# EAGLE design Party_Xmass_LED_controller (EAGLE 9.2.2)

## Sheet 1 of 3
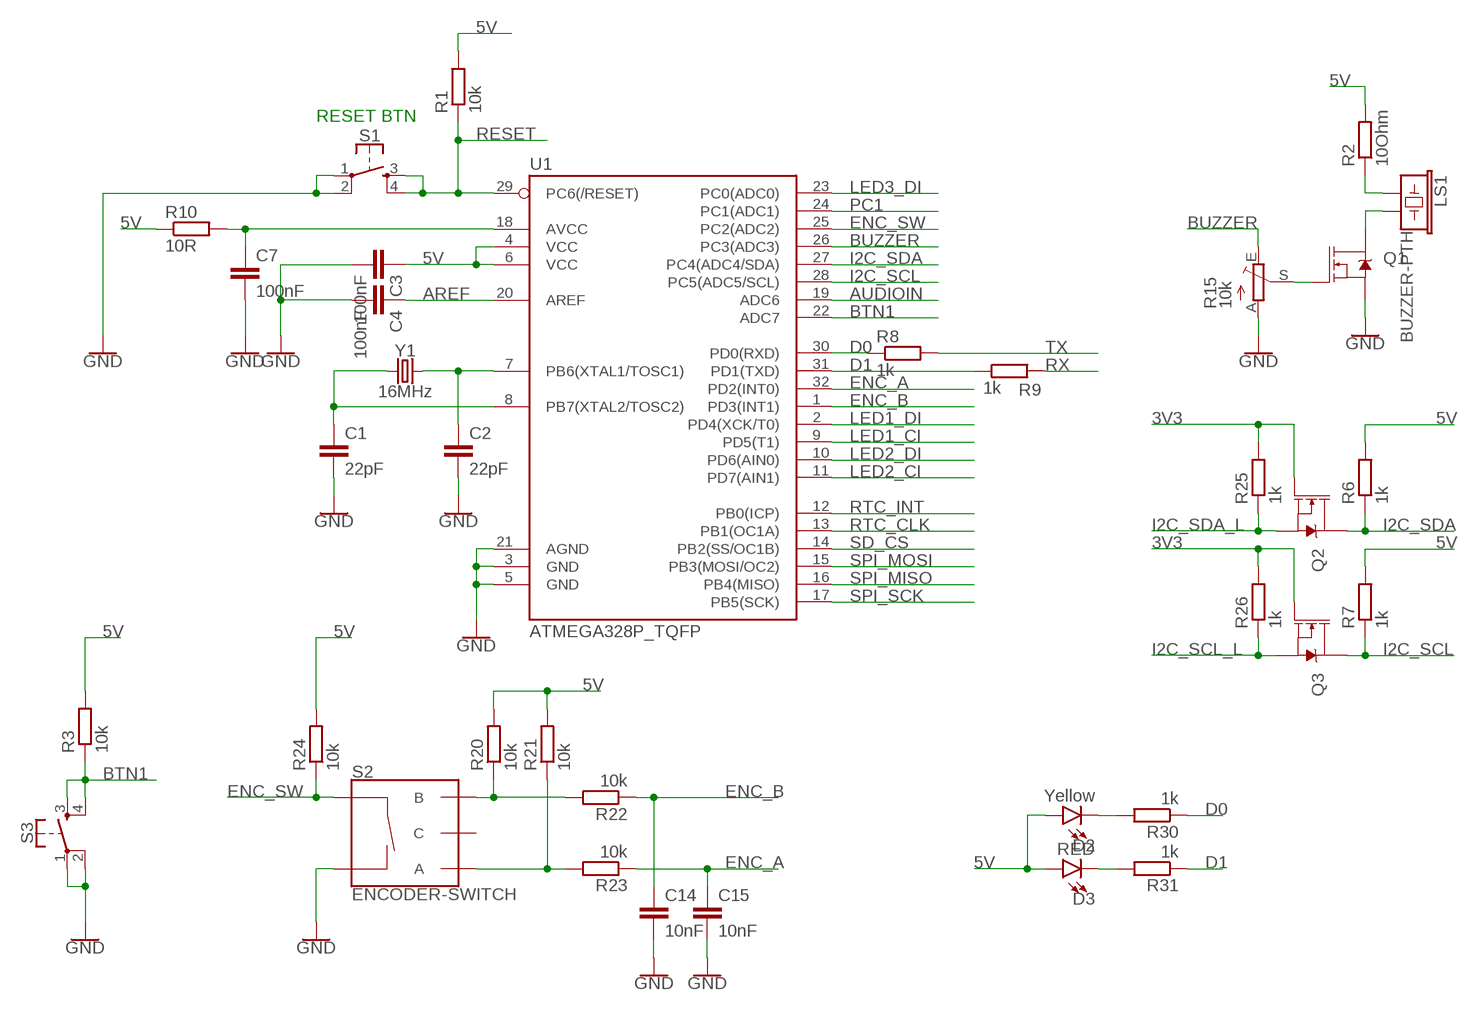
[diagram p0: schematic, sheet 1]

### Parts
C1  22pF  C-EUC0603  [C0603]
C2  22pF  C-EUC0603  [C0603]
C3  100nF  C-EUC0603  [C0603]
C4  100nF  C-EUC0603  [C0603]
C7  100nF  C-EUC0603  [C0603]
C14  10nF  C-EUC0603  [C0603]
C15  10nF  C-EUC0603  [C0603]
D2  Yellow  LED-YELLOW0603  [LED-0603]
D3  RED  LED-RED0603  [LED-0603]
LS1  BUZZER-PTH  [BUZZER-12MM]
Q1  MOSFET-NCH-BSS138  [SOT23-3]
Q2  MOSFET-NCH-BSS138  [SOT23-3]
Q3  MOSFET-NCH-BSS138  [SOT23-3]
R1  10k  R-EU_R0603  [R0603]
R2  10Ohm  R-EU_R0603  [R0603]
R3  10k  R-EU_R0603  [R0603]
R6  1k  R-EU_R0603  [R0603]
R7  1k  R-EU_R0603  [R0603]
R8  1k  R-EU_R0603  [R0603]
R9  1k  R-EU_R0603  [R0603]
R10  10R  R-EU_R0603  [R0603]
R15  10k  TRIM_EU-CA6V  [CA6V]
R20  10k  R-EU_R0603  [R0603]
R21  10k  R-EU_R0603  [R0603]
R22  10k  R-EU_R0603  [R0603]
R23  10k  R-EU_R0603  [R0603]
R24  10k  R-EU_R0603  [R0603]
R25  1k  R-EU_R0603  [R0603]
R26  1k  R-EU_R0603  [R0603]
R30  1k  R-EU_R0603  [R0603]
R31  1k  R-EU_R0603  [R0603]
S1  MOMENTARY-SWITCH-SPST-2-SMD-5.2MM  [TACTILE_SWITCH_SMD_5.2MM]
S2  ENCODER-SWITCH  [ROTARY_ENC_PLAIN]
S3  MOMENTARY-SWITCH-SPST-2-SMD-5.2MM  [TACTILE_SWITCH_SMD_5.2MM]
U1  ATMEGA328P_TQFP  [TQFP32-08]
Y1  16MHz  CRYSTAL-16MHZSMD-5X3.2  [CRYSTAL-SMD-5X3.2-4PAD]

### Nets
3V3: Q2.1(G) Q3.1(G) R25.2 R26.2 ; also sheet 2,3
5V: C3.1 D2.A D3.A R1.2 R2.2 R3.2 R6.2 R7.2 R10.1 R20.2 R21.2 R24.2 U1.4(VCC) U1.6(VCC) ; also sheet 2,3
AREF: C4.1 U1.20(AREF) ; also sheet 3
AUDIOIN: U1.19(ADC6) ; also sheet 3
BTN1: R3.1 S3.3 S3.4 U1.22(ADC7)
BUZZER: R15.E U1.26(PC3(ADC3))
D0: R8.1 R30.1 U1.30(PD0(RXD))
D1: R9.1 R31.1 U1.31(PD1(TXD))
ENC_A: C15.1 R23.1 U1.32(PD2(INT0))
ENC_B: C14.1 R22.1 U1.1(PD3(INT1))
ENC_SW: R24.1 S2.SW+ U1.25(PC2(ADC2))
GND: C1.2 C2.2 C3.2 C4.2 C7.2 C14.2 C15.2 Q1.2(S) R15.A S1.1 S1.2 S2.SW- S3.1 S3.2 U1.3(GND) U1.5(GND) U1.21(AGND) ; also sheet 2,3
I2C_SCL: Q3.3(D) R7.1 U1.28(PC5(ADC5/SCL)) ; also sheet 3
I2C_SCL_L: Q3.2(S) R26.1 ; also sheet 3
I2C_SDA: Q2.3(D) R6.1 U1.27(PC4(ADC4/SDA)) ; also sheet 3
I2C_SDA_L: Q2.2(S) R25.1 ; also sheet 3
LED1_CI: U1.9(PD5(T1)) ; also sheet 2
LED1_DI: U1.2(PD4(XCK/T0)) ; also sheet 2
LED2_CI: U1.11(PD7(AIN1)) ; also sheet 2
LED2_DI: U1.10(PD6(AIN0)) ; also sheet 2
LED3_DI: U1.23(PC0(ADC0)) ; also sheet 2
N$3: R20.1 R22.2 S2.B
N$4: LS1.- Q1.3(D)
N$5: LS1.+ R2.1
N$6: C2.1 U1.7(PB6(XTAL1/TOSC1)) Y1.3
N$7: C1.1 U1.8(PB7(XTAL2/TOSC2)) Y1.1
N$17: C7.1 R10.2 U1.18(AVCC)
N$18: R21.1 R23.2 S2.A
N$20: Q1.1(G) R15.S
N$40: D2.C R30.2
N$41: D3.C R31.2
PC1: U1.24(PC1(ADC1)) ; also sheet 3
RESET: R1.1 S1.3 S1.4 U1.29(PC6(/RESET)) ; also sheet 2,3
RTC_CLK: U1.13(PB1(OC1A)) ; also sheet 3
RTC_INT: U1.12(PB0(ICP)) ; also sheet 3
RX: R9.2 ; also sheet 2
SD_CS: U1.14(PB2(SS/OC1B)) ; also sheet 3
SPI_MISO: U1.16(PB4(MISO)) ; also sheet 3
SPI_MOSI: U1.15(PB3(MOSI/OC2)) ; also sheet 3
SPI_SCK: U1.17(PB5(SCK)) ; also sheet 3
TX: R8.2 ; also sheet 2
Unconnected: S2.C

### Notes on the sheet
- RESET BTN

## Sheet 2 of 3
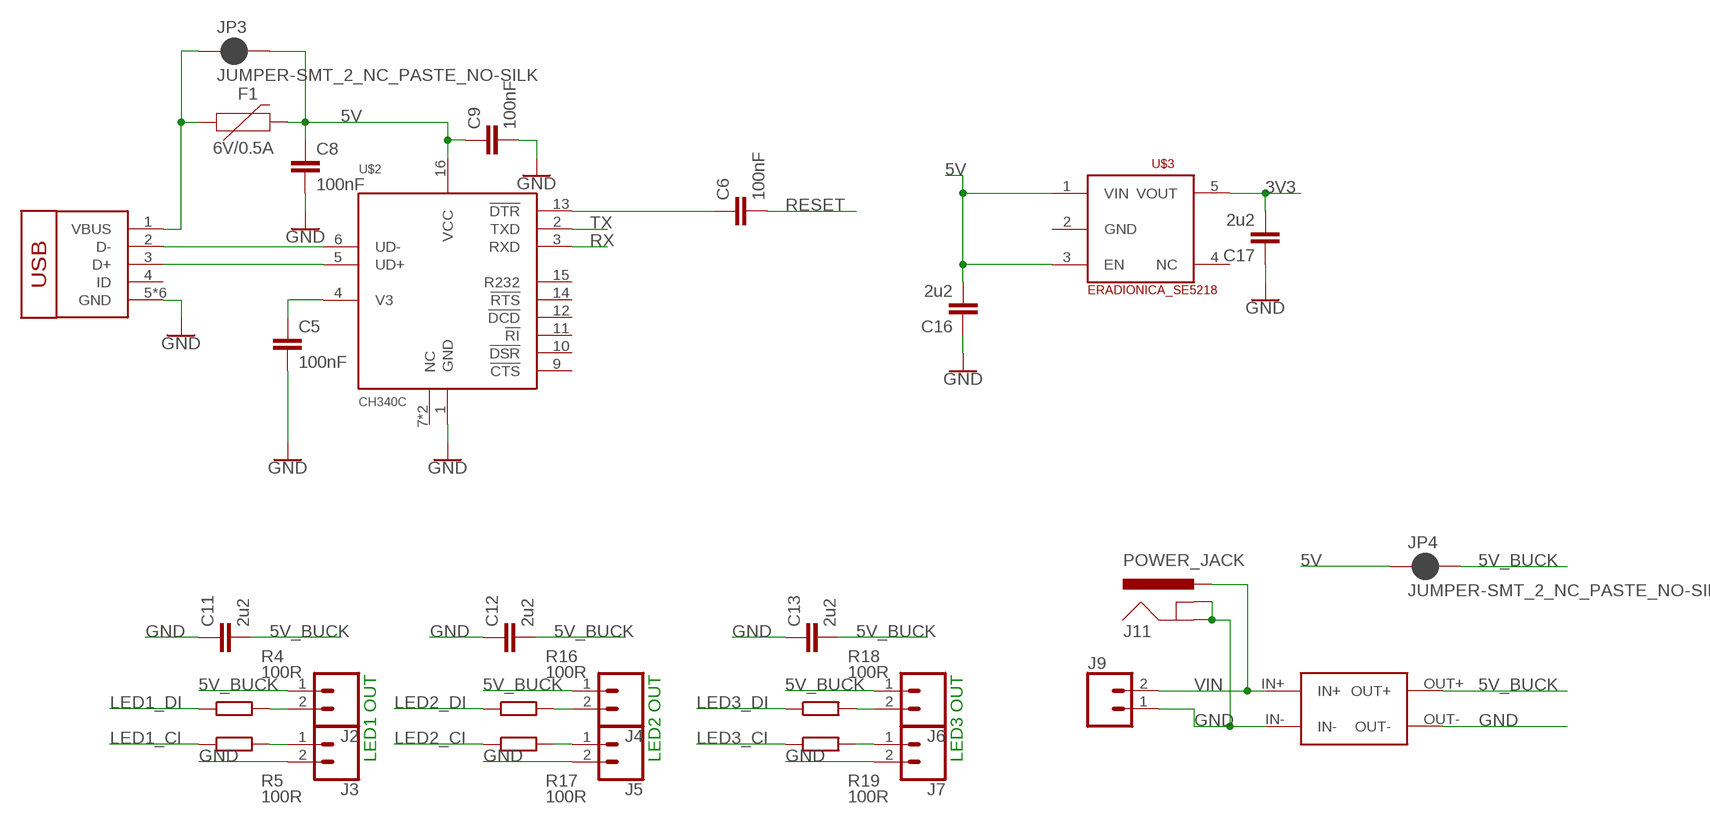
[diagram p1: schematic, sheet 2]

### Parts
C5  100nF  C-EUC0603  [C0603]
C6  100nF  C-EUC0603  [C0603]
C8  100nF  C-EUC0603  [C0603]
C9  100nF  C-EUC0603  [C0603]
C11  2u2  C-EUC0603  [C0603]
C12  2u2  C-EUC0603  [C0603]
C13  2u2  C-EUC0603  [C0603]
C16  2u2  C-EUC0603  [C0603]
C17  2u2  C-EUC0603  [C0603]
F1  6V/0.5A  PPTC_HALF-AMP  [1206]
J2  CONN_023.5MM  [SCREWTERMINAL-3.5MM-2]
J3  CONN_023.5MM  [SCREWTERMINAL-3.5MM-2]
J4  CONN_023.5MM  [SCREWTERMINAL-3.5MM-2]
J5  CONN_023.5MM  [SCREWTERMINAL-3.5MM-2]
J6  CONN_023.5MM  [SCREWTERMINAL-3.5MM-2]
J7  CONN_023.5MM  [SCREWTERMINAL-3.5MM-2]
J9  CONN_025MM  [SCREWTERMINAL-5MM-2]
J11  POWER_JACK  [POWER_JACK_PTH]
JP3  JUMPER-SMT_2_NC_PASTE_NO-SILK  [SMT-JUMPER_2_NC_PASTE_NO-SILK]
JP4  JUMPER-SMT_2_NC_PASTE_NO-SILK  [SMT-JUMPER_2_NC_PASTE_NO-SILK]
R4  100R  R-EU_R0603  [R0603]
R5  100R  R-EU_R0603  [R0603]
R16  100R  R-EU_R0603  [R0603]
R17  100R  R-EU_R0603  [R0603]
R18  100R  R-EU_R0603  [R0603]
R19  100R  R-EU_R0603  [R0603]
U$1  ERADIONICA_USB-MICRO  [ERADIONICA_U-F-M5DD-Y-L]
U$2  CH340C  [SOP-16]
U$3  ERADIONICA_SE5218  [ERADIONICA_SOT23-5]
U$4  STEPDOWN_MODULE_LM2596  [STEPDOWN_MODULE_LM2596]

### Nets
3V3: C17.2 U$3.5(VOUT) ; also sheet 1,3
5V: C8.1 C9.1 C16.2 F1.2 JP3.2 JP4.1 U$2.16(VCC) U$3.1(VIN) U$3.3(EN) ; also sheet 1,3
5V_BUCK: C11.2 C12.2 C13.2 J2.1 J4.1 J6.1 JP4.2 U$4.OUT+ ; also sheet 3
GND: C5.2 C8.2 C9.2 C11.1 C12.1 C13.1 C16.1 C17.1 J3.2 J5.2 J7.2 J9.1 J11.GND J11.GNDBREAK U$1.5(GND) U$1.PAD(GND) U$1.SHIELD1(GND) U$1.SHIELD2(GND) U$1.SHIELD3(GND) U$1.SHIELD4(GND) U$2.1(GND) U$4.IN- U$4.OUT- ; also sheet 1,3
LED1_CI: R5.1 ; also sheet 1
LED1_DI: R4.1 ; also sheet 1
LED2_CI: R17.1 ; also sheet 1
LED2_DI: R16.1 ; also sheet 1
LED3_CI: R19.1 ; also sheet 3
LED3_DI: R18.1 ; also sheet 1
N$8: C5.1 U$2.4(V3)
N$9: C6.1 U$2.13(!DTR)
N$14: U$1.2(D-) U$2.6(UD-)
N$15: U$1.3(D+) U$2.5(UD+)
N$16: F1.1 JP3.1 U$1.1(VBUS)
N$22: J2.2 R4.2
N$23: J3.1 R5.2
N$33: J4.2 R16.2
N$34: J5.1 R17.2
N$37: J6.2 R18.2
N$38: J7.1 R19.2
RESET: C6.2 ; also sheet 1,3
RX: U$2.3(RXD) ; also sheet 1
TX: U$2.2(TXD) ; also sheet 1
VIN: J9.2 J11.PWR U$4.IN+
Unconnected: U$1.4(ID) U$2.7(NC) U$2.8(NC) U$2.9(!CTS) U$2.10(!DSR) U$2.11(!RI) U$2.12(!DCD) U$2.14(!RTS) U$2.15(R232) U$3.2(GND) U$3.4(NC)

### Notes on the sheet
- LED1 OUT | LED2 OUT | LED3 OUT

## Sheet 3 of 3
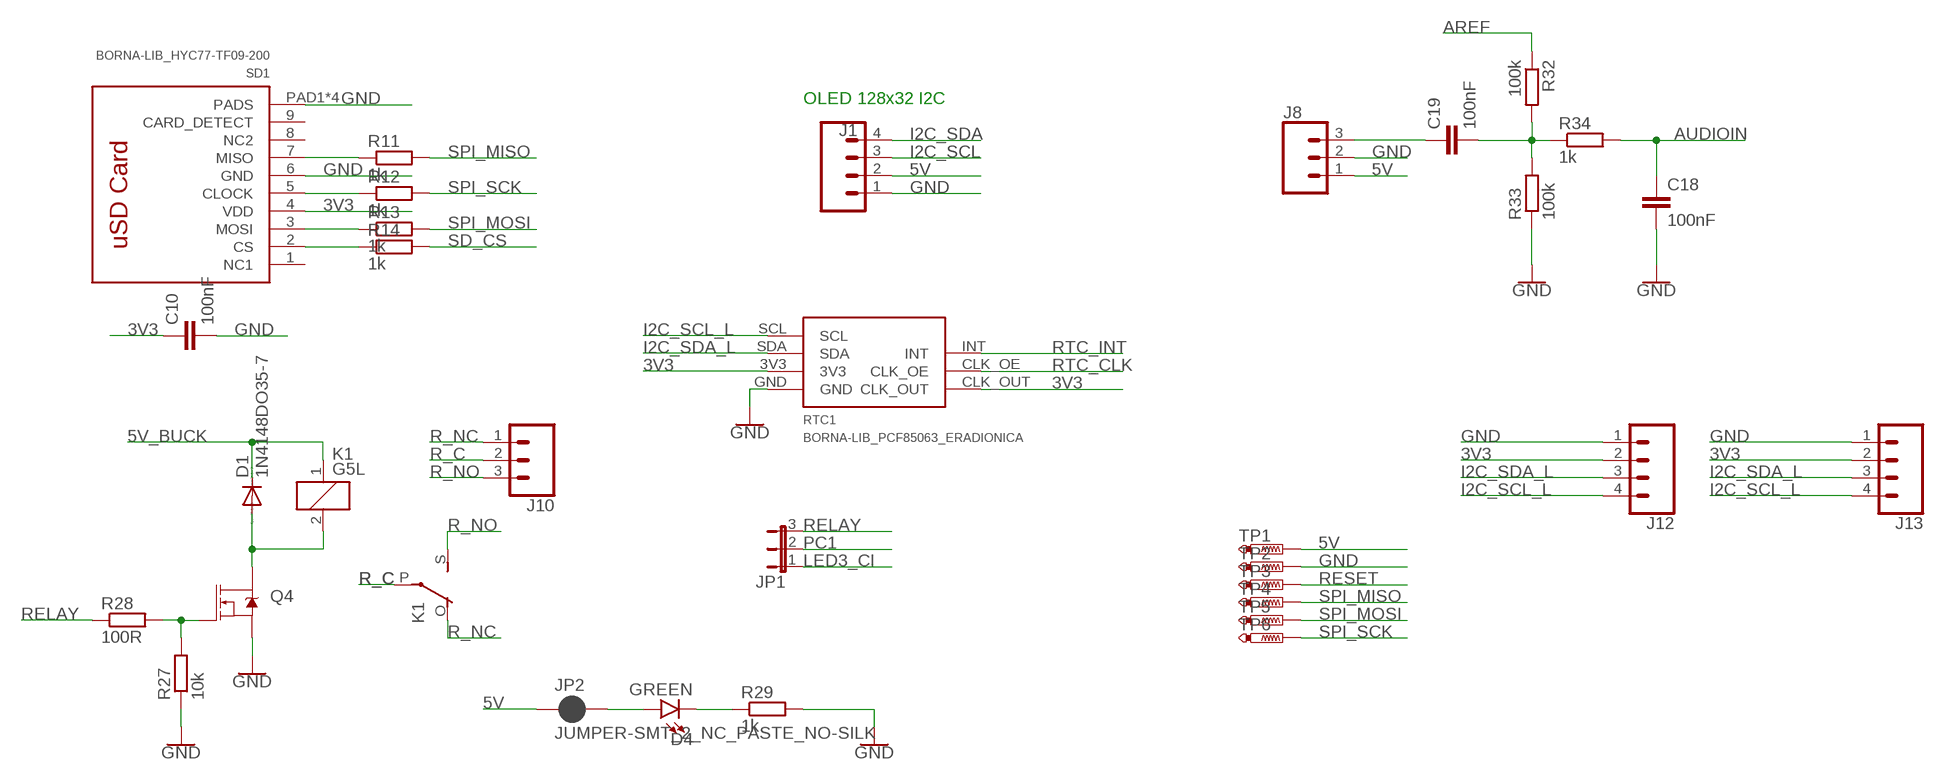
[diagram p2: schematic, sheet 3]

### Parts
C10  100nF  C-EUC0603  [C0603]
C18  100nF  C-EUC0603  [C0603]
C19  100nF  C-EUC0603  [C0603]
D1  1N4148DO35-7  [DO35-7]
D4  GREEN  LED-GREEN0603  [LED-0603]
J1  CONN_04  [1X04]
J8  CONN_03  [1X03]
J10  CONN_03SCREW  [SCREWTERMINAL-3.5MM-3]
J12  CONN_04SMD2  [1X04_1MM_RA]
J13  CONN_04SMD2  [1X04_1MM_RA]
JP1  JP2E  [JP2]
JP2  JUMPER-SMT_2_NC_PASTE_NO-SILK  [SMT-JUMPER_2_NC_PASTE_NO-SILK]
K1  G5L  [G5LE]
Q4  MOSFET-NCH-BSS138  [SOT23-3]
R11  1k  R-EU_R0603  [R0603]
R12  1k  R-EU_R0603  [R0603]
R13  1k  R-EU_R0603  [R0603]
R14  1k  R-EU_R0603  [R0603]
R27  10k  R-EU_R0603  [R0603]
R28  100R  R-EU_R0603  [R0603]
R29  1k  R-EU_R0603  [R0603]
R32  100k  R-EU_R0603  [R0603]
R33  100k  R-EU_R0603  [R0603]
R34  1k  R-EU_R0603  [R0603]
RTC1  BORNA-LIB_PCF85063_ERADIONICA  [BORNA-LIB_PCF85063_ERADIONICA]
SD1  BORNA-LIB_HYC77-TF09-200  [BORNA-LIB_MICROSD_HOLDER]
TP1  PTR1B1,27  [B1,27]
TP2  PTR1B1,27  [B1,27]
TP3  PTR1B1,27  [B1,27]
TP4  PTR1B1,27  [B1,27]
TP5  PTR1B1,27  [B1,27]
TP6  PTR1B1,27  [B1,27]

### Nets
3V3: C10.1 J12.2 J13.2 RTC1.3V3 RTC1.CLK_OUT SD1.4(VDD) ; also sheet 1,2
5V: J1.2 J8.1 JP2.1 TP1.TP ; also sheet 1,2
5V_BUCK: D1.C K1.1 ; also sheet 2
AREF: R32.1 ; also sheet 1
AUDIOIN: C18.1 R34.2 ; also sheet 1
GND: C10.2 C18.2 J1.1 J8.2 J12.1 J13.1 Q4.2(S) R27.1 R29.2 R33.1 RTC1.GND SD1.6(GND) SD1.PAD1(PADS) SD1.PAD2(PADS) SD1.PAD3(PADS) SD1.PAD4(PADS) TP2.TP ; also sheet 1,2
I2C_SCL: J1.3 ; also sheet 1
I2C_SCL_L: J12.4 J13.4 RTC1.SCL ; also sheet 1
I2C_SDA: J1.4 ; also sheet 1
I2C_SDA_L: J12.3 J13.3 RTC1.SDA ; also sheet 1
LED3_CI: JP1.1 ; also sheet 2
MICIN: C19.2 R32.2 R33.2 R34.1
N$1: C19.1 J8.3
N$25: R11.1 SD1.7(MISO)
N$26: R12.1 SD1.5(CLOCK)
N$27: R13.1 SD1.3(MOSI)
N$28: R14.1 SD1.2(CS)
N$30: Q4.1(G) R27.2 R28.2
N$31: D1.A K1.2 Q4.3(D)
N$36: D4.A JP2.2
N$39: D4.C R29.1
PC1: JP1.2 ; also sheet 1
R_C: J10.2 K1.P(2:P)
R_NC: J10.1 K1.O(2:O)
R_NO: J10.3 K1.S(2:S)
RELAY: JP1.3 R28.1
RESET: TP3.TP ; also sheet 1,2
RTC_CLK: RTC1.CLK_OE ; also sheet 1
RTC_INT: RTC1.INT ; also sheet 1
SD_CS: R14.2 ; also sheet 1
SPI_MISO: R11.2 TP4.TP ; also sheet 1
SPI_MOSI: R13.2 TP5.TP ; also sheet 1
SPI_SCK: R12.2 TP6.TP ; also sheet 1
Unconnected: SD1.1(NC1) SD1.8(NC2) SD1.9(CARD_DETECT)

### Notes on the sheet
- OLED 128x32 I2C

## Library data of the parts
C1-C19 = rcl:C-EU: CAPACITOR, European symbol; SPICEPREFIX: C
D1 = diode:1N4148: DIODE high speed (Philips)
D2 = SparkFun-LED:LED-YELLOW: Yellow SMD LED Used in manufacturing several products at SparkFun. Packages: 0603 - SMD 0603 package[Product Link] <http://www.kingbrightusa.com/product.asp?catalog_name=LED&product_id=APT1608SYCK> 0603 -SMART - SMART SMD 0603 package (more efficient/more expensive) [Product Link] <http://www.osram-os.com/osram_os/en/products/product-catalog/led-light-emitting-diodes/smartled-0603/ly-l29k/index.jsp> LilyPad - SMD1206 package[Product Datasheet] <https://www.sparkfun.com/datasheets/DevTools/LilyPad/Q150YUS4.pdf> SparkFun Products: Blynk Board <https://www.sparkfun.com/products/13794> IOIO-OTG <https://www.sparkfun.com/products/13613> XBee Explorer Serial <https://www.sparkfun.com/products/13225>; PROD_ID: DIO-09003
D3 = SparkFun-LED:LED-RED: Red SMD LED Used in manufacturing of most products at SparkFun Packages: 0603 - SMD 0603 package [Product Link] <http://docs.avagotech.com/docs/AV02-0551EN> 0603 SMART - SMD 0603 SMART package ( more efficient and expensive)[Product Link] <http://www.osram-os.com/Graphics/XPic2/00077099_0.pdf> 1206 - SMD1206 package [Product Link] <https://www.sparkfun.com/datasheets/DevTools/LilyPad/Q150OVS4.pdff> SparkFun Products: Pro Mini 328 -5V <https://www.sparkfun.com/products/821> RedBoard <https://www.sparkfun.com/products/12757> IOIO-OTG <https://www.sparkfun.com/products/13613>; PROD_ID: DIO-00819
D4 = SparkFun-LED:LED-GREEN: Green SMD LED Used in manufacturing of various products at SparkFun Packages: 0603 - SMD 0603 package [Product Link] <http://www.futureelectronics.com/en/technologies/semiconductors/optoelectronics/leds/Pages/9894312-LTST-C190GKT.aspx?CrossPart=HSMG-C190&IM=0> LilyPad 1206 - SMD1206 LilyPad package [Product Link] <http://www.futureelectronics.com/en/Technologies/Product.aspx?ProductID=IN150NGHARVATEKCORPORATION2049943&IM=0> 1206 - SMD1206 package [Product Link] <http://www.futureelectronics.com/en/technologies/semiconductors/optoelectronics/leds/Pages/8315665-LTST-C150KGKT.aspx?IM=0> 1206 Bottom Mount -SMD 1206 Bottom Mount [Product Link] <http://www.digikey.com/product-detail/en/lite-on-inc/LTST-C230KGKT/160-1456-1-ND/386854> SparkFun Products: Pro Mini 328 -5V <https://www.sparkfun.com/products/821> RedBoard <https://www.sparkfun.com/products/12757> MP3 Trigger <https://www.sparkfun.com/products/13720> Makey Makey <https://www.sparkfun.com/products/11076>; PROD_ID: DIO-00821
F1 = SparkFun-Fuses:PPTC: Resettable Fuse PPTC Resettable Fuse. Really a sort of resistor with a polymeric positive temperature coefficient whose resistance increases dramatically with an increase in temperature. When heated by the power passing through the resistance rises causing the current to be limited, protecting the circuit. This is achieved by the transition of the polymer from a crystalline to an amorphous state where the conductive carbon separates breaking the conductive pathways found in the cool crystalline structure. When a PPTC cools back down it resumes conducting letting the circuit turn back on. SparkFun Products: SparkFun RedBoard - Programmed with Arduino <https://www.sparkfun.com/products/12757> Pro Micro - 5V/16MHz <https://www.sparkfun.com/products/12640> Arduino Pro 328 - 5V/16MHz <https://www.sparkfun.com/products/10915> MP3 Trigger <https://www.sparkfun.com/products/13720>; PROD_ID: RES-08585
J1 = SparkFun-Connectors:CONN_04: Multi connection point. Often used as Generic Header-pin footprint for 0.1 inch spaced/style header connections On any of the 0.1 inch spaced packages, you can populate with these: Break Away Headers - Straight <https://www.sparkfun.com/products/116> (PRT-00116) Break Away Male Headers - Right Angle <https://www.sparkfun.com/products/553> (PRT-00553) Female Headers <https://www.sparkfun.com/products/115> (PRT-00115) Break Away Headers - Machine Pin <https://www.sparkfun.com/products/117> (PRT-00117) Break Away Female Headers - Swiss Machine Pin <https://www.sparkfun.com/products/743> (PRT-00743) For SCREWTERMINALS and SPRING TERMINALS visit here: Screw Terimnals on SparkFun.com <https://www.sparkfun.com/search/results?term=Screw+Terminals> (5mm/3.5mm/2.54mm spacing) This device is also useful as a general connection point to wire up your design to another part of your project. Our various solder wires solder well into these plated through hole pads. Hook-Up Wire - Assortment (Stranded, 22 AWG) <https://www.sparkfun.com/products/11375> (PRT-11375) Hook-Up Wire - Assortment (Solid Core, 22 AWG) <https://www.sparkfun.com/products/11367> (PRT-11367) View the entire wire category on our website here <https://www.sparkfun.com/categories/141> Special notes: Molex polarized connector foot print use with SKU : PRT-08231 with associated crimp pins and housings. 1MM SMD Version SKU: PRT-10208; PROD_ID: CONN-09696
J2-J7 = SparkFun-Connectors:CONN_02: Multi connection point. Often used as Generic Header-pin footprint for 0.1 inch spaced/style header connections On any of the 0.1 inch spaced packages, you can populate with these: Break Away Headers - Straight <https://www.sparkfun.com/products/116> (PRT-00116) Break Away Male Headers - Right Angle <https://www.sparkfun.com/products/553> (PRT-00553) Female Headers <https://www.sparkfun.com/products/115> (PRT-00115) Break Away Headers - Machine Pin <https://www.sparkfun.com/products/117> (PRT-00117) Break Away Female Headers - Swiss Machine Pin <https://www.sparkfun.com/products/743> (PRT-00743) For SCREWTERMINALS and SPRING TERMINALS visit here: Screw Terimnals on SparkFun.com <https://www.sparkfun.com/search/results?term=Screw+Terminals> (5mm/3.5mm/2.54mm spacing) This device is also useful as a general connection point to wire up your design to another part of your project. Our various solder wires solder well into these plated through hole pads. Hook-Up Wire - Assortment (Stranded, 22 AWG) <https://www.sparkfun.com/products/11375> (PRT-11375) Hook-Up Wire - Assortment (Solid Core, 22 AWG) <https://www.sparkfun.com/products/11367> (PRT-11367) View the entire wire category on our website here <https://www.sparkfun.com/categories/141> Special notes: Molex polarized connector foot print use with: PRT-08233 with associated crimp pins and housings. 2.54_SCREWTERM for use with PRT-10571. 3.5mm Screw Terminal footprints for PRT-08084 5mm Screw Terminal footprints for use with PRT-08432; PROD_ID: CONN-08399
J8 = SparkFun-Connectors:CONN_03: Multi connection point. Often used as Generic Header-pin footprint for 0.1 inch spaced/style header connections On any of the 0.1 inch spaced packages, you can populate with these: Break Away Headers - Straight <https://www.sparkfun.com/products/116> (PRT-00116) Break Away Male Headers - Right Angle <https://www.sparkfun.com/products/553> (PRT-00553) Female Headers <https://www.sparkfun.com/products/115> (PRT-00115) Break Away Headers - Machine Pin <https://www.sparkfun.com/products/117> (PRT-00117) Break Away Female Headers - Swiss Machine Pin <https://www.sparkfun.com/products/743> (PRT-00743) Stackable Header - 3 Pin (Female, 0.1") <https://www.sparkfun.com/products/13875> (PRT-13875) For SCREWTERMINALS and SPRING TERMINALS visit here: Screw Terimnals on SparkFun.com <https://www.sparkfun.com/search/results?term=Screw+Terminals> (5mm/3.5mm/2.54mm spacing) This device is also useful as a general connection point to wire up your design to another part of your project. Our various solder wires solder well into these plated through hole pads. Hook-Up Wire - Assortment (Stranded, 22 AWG) <https://www.sparkfun.com/products/11375> (PRT-11375) Hook-Up Wire - Assortment (Solid Core, 22 AWG) <https://www.sparkfun.com/products/11367> (PRT-11367) View the entire wire category on our website here <https://www.sparkfun.com/categories/141> Special notes: Molex polarized connector foot print use with SKU : PRT-08232 with associated crimp pins and housings.
J9 = SparkFun-Connectors:CONN_02: Multi connection point. Often used as Generic Header-pin footprint for 0.1 inch spaced/style header connections On any of the 0.1 inch spaced packages, you can populate with these: Break Away Headers - Straight <https://www.sparkfun.com/products/116> (PRT-00116) Break Away Male Headers - Right Angle <https://www.sparkfun.com/products/553> (PRT-00553) Female Headers <https://www.sparkfun.com/products/115> (PRT-00115) Break Away Headers - Machine Pin <https://www.sparkfun.com/products/117> (PRT-00117) Break Away Female Headers - Swiss Machine Pin <https://www.sparkfun.com/products/743> (PRT-00743) For SCREWTERMINALS and SPRING TERMINALS visit here: Screw Terimnals on SparkFun.com <https://www.sparkfun.com/search/results?term=Screw+Terminals> (5mm/3.5mm/2.54mm spacing) This device is also useful as a general connection point to wire up your design to another part of your project. Our various solder wires solder well into these plated through hole pads. Hook-Up Wire - Assortment (Stranded, 22 AWG) <https://www.sparkfun.com/products/11375> (PRT-11375) Hook-Up Wire - Assortment (Solid Core, 22 AWG) <https://www.sparkfun.com/products/11367> (PRT-11367) View the entire wire category on our website here <https://www.sparkfun.com/categories/141> Special notes: Molex polarized connector foot print use with: PRT-08233 with associated crimp pins and housings. 2.54_SCREWTERM for use with PRT-10571. 3.5mm Screw Terminal footprints for PRT-08084 5mm Screw Terminal footprints for use with PRT-08432; SF_SKU: PRT-08432
J10 = SparkFun-Connectors:CONN_03: Multi connection point. Often used as Generic Header-pin footprint for 0.1 inch spaced/style header connections On any of the 0.1 inch spaced packages, you can populate with these: Break Away Headers - Straight <https://www.sparkfun.com/products/116> (PRT-00116) Break Away Male Headers - Right Angle <https://www.sparkfun.com/products/553> (PRT-00553) Female Headers <https://www.sparkfun.com/products/115> (PRT-00115) Break Away Headers - Machine Pin <https://www.sparkfun.com/products/117> (PRT-00117) Break Away Female Headers - Swiss Machine Pin <https://www.sparkfun.com/products/743> (PRT-00743) Stackable Header - 3 Pin (Female, 0.1") <https://www.sparkfun.com/products/13875> (PRT-13875) For SCREWTERMINALS and SPRING TERMINALS visit here: Screw Terimnals on SparkFun.com <https://www.sparkfun.com/search/results?term=Screw+Terminals> (5mm/3.5mm/2.54mm spacing) This device is also useful as a general connection point to wire up your design to another part of your project. Our various solder wires solder well into these plated through hole pads. Hook-Up Wire - Assortment (Stranded, 22 AWG) <https://www.sparkfun.com/products/11375> (PRT-11375) Hook-Up Wire - Assortment (Solid Core, 22 AWG) <https://www.sparkfun.com/products/11367> (PRT-11367) View the entire wire category on our website here <https://www.sparkfun.com/categories/141> Special notes: Molex polarized connector foot print use with SKU : PRT-08232 with associated crimp pins and housings.; PROD_ID: CONN-08288; SF_ID: PRT-08235
J11 = SparkFun-Connectors:POWER_JACK: Power Jack Connector This is the standard 5.5mm barrel jack for power. The PTH is the most common, proven, reliable, footprint. The Slot footprint only works if the mill layer is transmitted to the PCB fab house so be warned. Here are the connectors we sell at SparkFun: DC Barrel Power Jack/Connector <https://www.sparkfun.com/products/119> (PRT-00119) DC Barrel Power Jack/Connector (SMD) <https://www.sparkfun.com/products/12748> (PRT-12748) DC Barrel Jack Adapter - Breadboard Compatible <https://www.sparkfun.com/products/10811> (PRT-10811) It is used on this SparkFun product (and many, many others): SparkFun RedBoard - Programmed with Arduino <https://www.sparkfun.com/products/12757> (DEV-12757) Also, if you need a mating power supply or connector, please check these out: Wall Adapter Power Supply - 9VDC 650mA <https://www.sparkfun.com/products/298> (TOL-00298) DC Barrel Jack Adapter - Male <https://www.sparkfun.com/products/10287> (PRT-10287); PROD_ID: CONN-08197
J12 J13 = SparkFun-Connectors:CONN_04: Multi connection point. Often used as Generic Header-pin footprint for 0.1 inch spaced/style header connections On any of the 0.1 inch spaced packages, you can populate with these: Break Away Headers - Straight <https://www.sparkfun.com/products/116> (PRT-00116) Break Away Male Headers - Right Angle <https://www.sparkfun.com/products/553> (PRT-00553) Female Headers <https://www.sparkfun.com/products/115> (PRT-00115) Break Away Headers - Machine Pin <https://www.sparkfun.com/products/117> (PRT-00117) Break Away Female Headers - Swiss Machine Pin <https://www.sparkfun.com/products/743> (PRT-00743) For SCREWTERMINALS and SPRING TERMINALS visit here: Screw Terimnals on SparkFun.com <https://www.sparkfun.com/search/results?term=Screw+Terminals> (5mm/3.5mm/2.54mm spacing) This device is also useful as a general connection point to wire up your design to another part of your project. Our various solder wires solder well into these plated through hole pads. Hook-Up Wire - Assortment (Stranded, 22 AWG) <https://www.sparkfun.com/products/11375> (PRT-11375) Hook-Up Wire - Assortment (Solid Core, 22 AWG) <https://www.sparkfun.com/products/11367> (PRT-11367) View the entire wire category on our website here <https://www.sparkfun.com/categories/141> Special notes: Molex polarized connector foot print use with SKU : PRT-08231 with associated crimp pins and housings. 1MM SMD Version SKU: PRT-10208; PROD_ID: CONN-10310; SF_ID: PRT-10208
JP1 = jumper:JP2E: JUMPER
JP2-JP4 = SparkFun-Jumpers:JUMPER-SMT_2_NC_PASTE: Normally closed solder jumper This jumper has an aperture in the stencil to allow solder paste to bridge the split in the wire so it's normally closed (NC). Wick off the solder to open the connection. Reapply solder to reclose the connection.
K1 = relay:G5L: RELAY 1 x switch, 10 A/120 V AC, 8 A/30 V ADC, Omron; OC_FARNELL: unknown; OC_NEWARK: unknown
LS1 = SparkFun-Electromechanical:BUZZER: Buzzer Small round buzzers that operate around the audible 2kHz range. You can use these as speakers to create simple music or user interfaces. Variant Overview: PTH - Mini Speaker - PC Mount 12mm 2.048kHz <https://www.sparkfun.com/products/7950> PTH_KIT - Mini Speaker - PC Mount 12mm 2.048kHz <https://www.sparkfun.com/products/7950> KIT simplifies soldering by adding stop mask to one side of the pads. PTH_NO_SILK - Mini Speaker - PC Mount 12mm 2.048kHz <https://www.sparkfun.com/products/7950> No silkscreen indicator of buzzer outline. PTH_KIT_NO_SILK - Mini Speaker - PC Mount 12mm 2.048kHz <https://www.sparkfun.com/products/7950> KIT package w/o silkscreen SMD - Buzzer Audio Magnetic (CCV-084B16) SMD buzzer used on, e.g. the LilyPad Buzzer <https://www.sparkfun.com/products/8463> and RFID USB Reader <https://www.sparkfun.com/products/9963>. SMD_KIT - Buzzer Audio Magnetic (CCV-084B16) SMD Buzzer with elongated pins to make soldering easier. Used on the SparkFun Simon Says - Surface Mount Soldering Kit <https://www.sparkfun.com/products/10935>.; PROD_ID: COMP-08253; SF_SKU: COM-07950
Q1-Q4 = SparkFun-DiscreteSemi:MOSFET-NCH: N-channel MOSFETs Voltage controlled devices that allow control of high current outputs. SparkFun Products: SparkFun OpenScale <https://www.sparkfun.com/products/13261> SparkFun Digital Sandbox <https://www.sparkfun.com/products/12651> SparkFun Monster Moto Shield <https://www.sparkfun.com/products/10182> SparkFun MOSFET Power Controller <https://www.sparkfun.com/products/11214>; PROD_ID: TRANS-00830; VALUE: 220mA/50V/3.5Ω
R1-R14 R16-R34 = rcl:R-EU_: RESISTOR, European symbol; SPICEPREFIX: R
R15 = pot:TRIM_EU-: POTENTIOMETER
RTC1 = Borna_erad:BORNA-LIB_PCF85063_ERADIONICA
S1 S3 = SparkFun-Switches:MOMENTARY-SWITCH-SPST-2: Momentary Switch (Pushbutton) - SPST - Two Circuits Normally-open (NO) SPST momentary switches (buttons, pushbuttons). Schematic symbol includes two switch circuits. Variants SMD-4.6MMX2.8MM - 4.60mm x 2.80mm Tactile Momentary Button Switch - Used on SparkFun SAMD21 Mini Breakout <https://www.sparkfun.com/products/13664> SMD-5.2MM - Mini Pushbutton Switch - SMD <https://www.sparkfun.com/products/8720> - Used on Arduino Pro Mini <https://www.sparkfun.com/products/11114>; PROD_ID: SWCH-08247; SF_SKU: COM-08720
S2 = SparkFun-Switches:ENCODER-SWITCH: Rotary Encoder w/ Select Switch Encoders rotate similarly to potentiometers, but they’re different from potentiometers in that an encoder has full rotation without limits. They output gray code so that you can tell how much and in which direction the encoder has been turned. This encoder includes a push-down select switch built into the shaft. SparkFun Products Rotary Encoder <https://www.sparkfun.com/products/9117> (COM-09117); SF_SKU: COM-09117
SD1 = Borna_erad:BORNA-LIB_HYC77-TF09-200
TP1-TP6 = testpad:PTR1: TEST PIN
U1 = SparkFun-IC-Microcontroller:ATMEGA328P_TQFP: Popular 328P in QFP Storefront component: ATmega328 - TQFP <https://www.sparkfun.com/products/13448> (COM-13448) Datasheet <http://www.sparkfun.com/datasheets/Components/SMD/ATMega328.pdf> SparkFun Products SparkFun RedBoard - Programmed with Arduino <https://www.sparkfun.com/products/12757> (DEV-12757) Arduino Pro Mini 328 - 5V/16MHz <https://www.sparkfun.com/products/11113> (DEV-11113) Arduino Pro Mini 328 - 3.3V/8MHz <https://www.sparkfun.com/products/11114> (DEV-11114) SparkFun OpenLog <https://www.sparkfun.com/products/13712> (DEV-13712) SparkFun MicroView - OLED Arduino Module <https://www.sparkfun.com/products/12923> (DEV-12923) SparkFun Digital Sandbox <https://www.sparkfun.com/products/12651> (DEV-12651) SparkFun PicoBoard <https://www.sparkfun.com/products/11888> (WIG-11888) Arduino Fio <https://www.sparkfun.com/products/10116> (DEV-10116) LilyPad Arduino 328 Main Board <https://www.sparkfun.com/products/13342> (DEV-13342) SparkFun RedStick <https://www.sparkfun.com/products/13741> (DEV-13741) LilyPad MP3 <https://www.sparkfun.com/products/11013> (DEV-11013) LilyPad Arduino SimpleSnap <https://www.sparkfun.com/products/10941> (DEV-10941) SparkFun Stepoko <https://www.sparkfun.com/products/13899> (ROB-13899) SparkFun Geiger Counter <https://www.sparkfun.com/products/11345> (SEN-11345) SparkFun EL Sequencer <https://www.sparkfun.com/products/12781> (COM-12781) Arduino Pro 328 - 5V/16MHz <https://www.sparkfun.com/products/10915> (DEV-10915) CryptoCape <https://www.sparkfun.com/products/12773> (DEV-12773) SparkFun IR Thermometer Evaluation Board - MLX90614 <https://www.sparkfun.com/products/10740> (SEN-10740) SparkFun RedBot Mainboard <https://www.sparkfun.com/products/12097> (ROB-12097) Arduino Pro 328 - 3.3V/8MHz <https://www.sparkfun.com/products/10914> (DEV-10914) SparkFun Block for Intel® Edison - Arduino <https://www.sparkfun.com/products/13036> (DEV-13036) SparkFun Simon Says - Surface Mount Soldering Kit <https://www.sparkfun.com/products/10935> (KIT-10935) SparkFun 7-Segment Serial Display - Red <https://www.sparkfun.com/products/11441> (COM-11441) SparkFun 7-Segment Serial Display - White <https://www.sparkfun.com/products/11629> (COM-11629) SparkFun 7-Segment Serial Display - Yellow <https://www.sparkfun.com/products/11443> (COM-11443) SparkFun 7-Segment Serial Display - Kelly Green <https://www.sparkfun.com/products/11440> (COM-11440) SparkFun 7-Segment Serial Display - Blue <https://www.sparkfun.com/products/11442> (COM-11442) SparkFun OpenSegment Serial Display - 20mm (Blue) <https://www.sparkfun.com/products/11647> (COM-11647) SparkFun OpenSegment Serial Display - 20mm (Green) <https://www.sparkfun.com/products/11646> (COM-11646) SparkFun OpenSegment Serial Display - 20mm (White) <https://www.sparkfun.com/products/11648> (COM-11648) SparkFun OpenSegment Serial Display - 20mm (Red) <https://www.sparkfun.com/products/11644> (COM-11644) SparkFun OpenSegment Serial Display - 20mm (Yellow) <https://www.sparkfun.com/products/11645> (COM-11645) SparkFun OpenSegment Shield <https://www.sparkfun.com/products/13190> (DEV-13190); PROD_ID: IC-09069
U$1 = Basic3:ERADIONICA_USB-MICRO
U$2 = borna:CH340C
U$3 = Basic3:ERADIONICA_SE5218
U$4 = borna:STEPDOWN_MODULE_LM2596
Y1 = SparkFun-Clocks:CRYSTAL-16MHZ: 16MHz Crystal Digikey Example <http://www.digikey.com/product-search/en?keywords=535-9122-1-ND> Frequency: 16MHz Frequency Stability: ±50ppm Frequency Tolerance: ±20ppm Load Capacitance: 18pF SparkFun Products: Pro Micro -5V/16MHz <https://www.sparkfun.com/products/12640> SparkFun Serial Enabled LCD Kit <https://www.sparkfun.com/products/10097>; PROD_ID: XTAL-08218; SF_ID: COM-00094

## Board
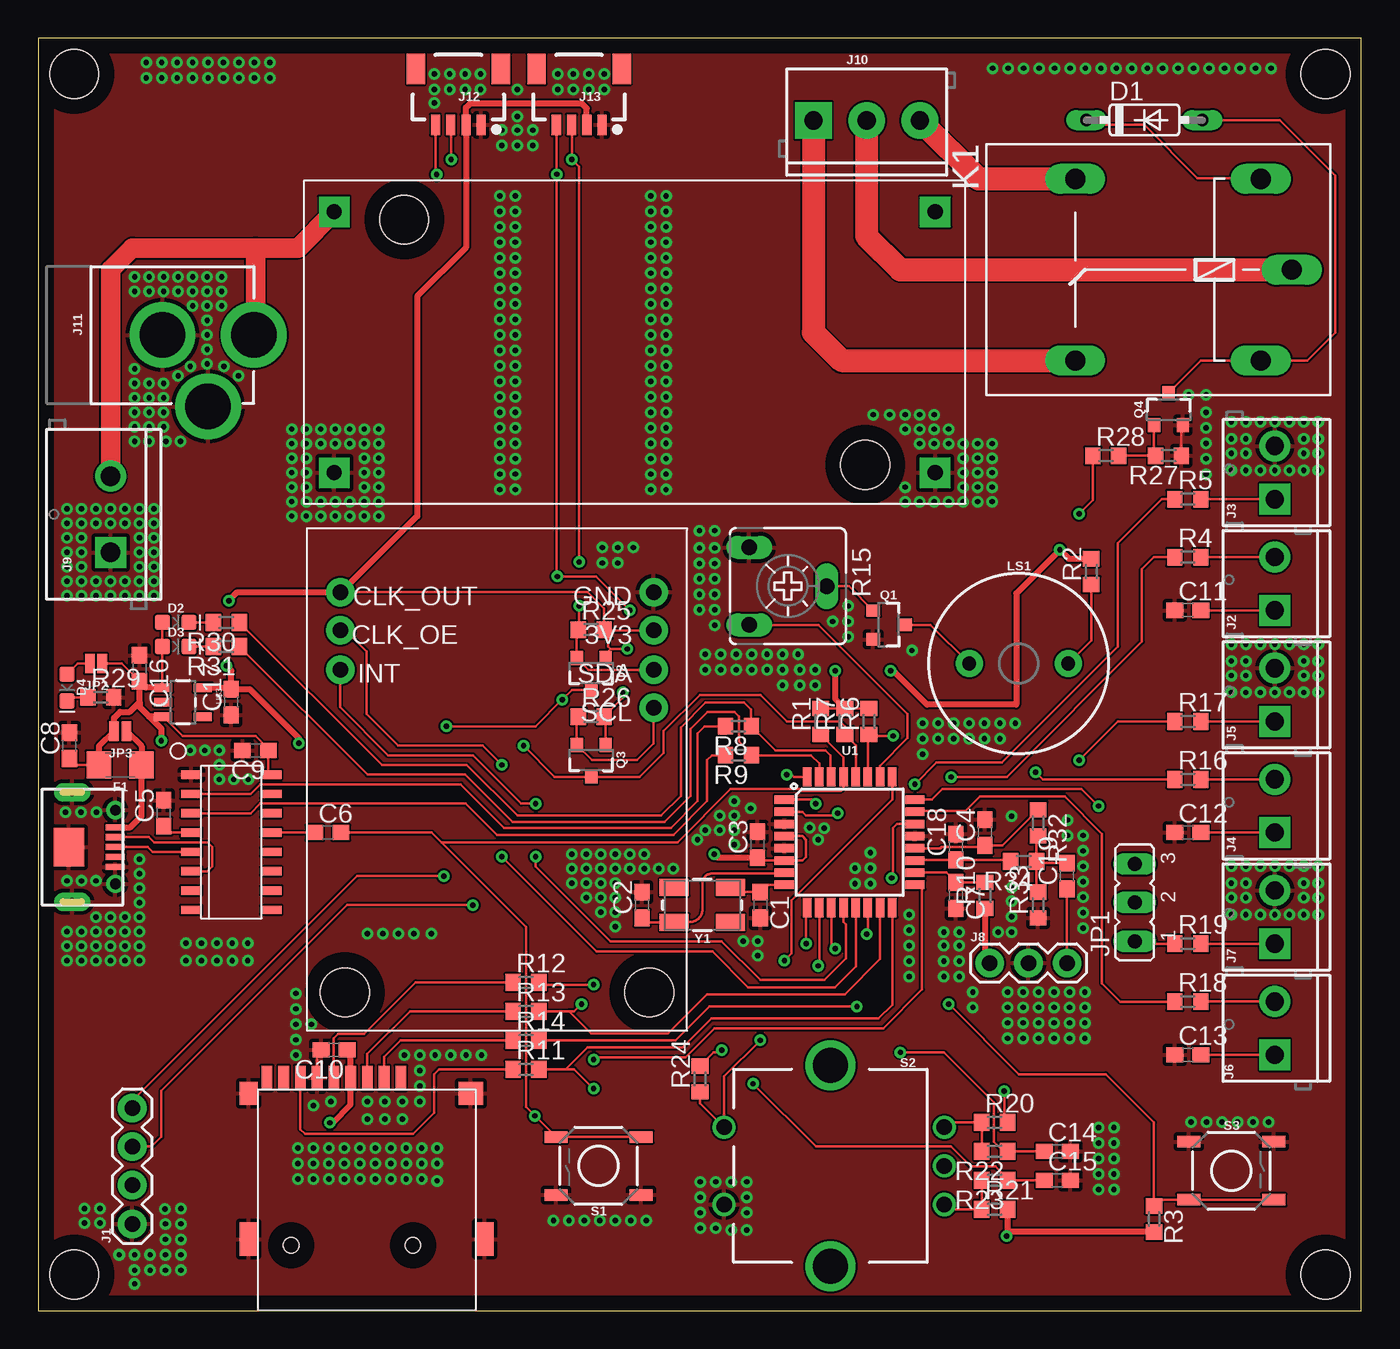
[diagram p3: board, top side]
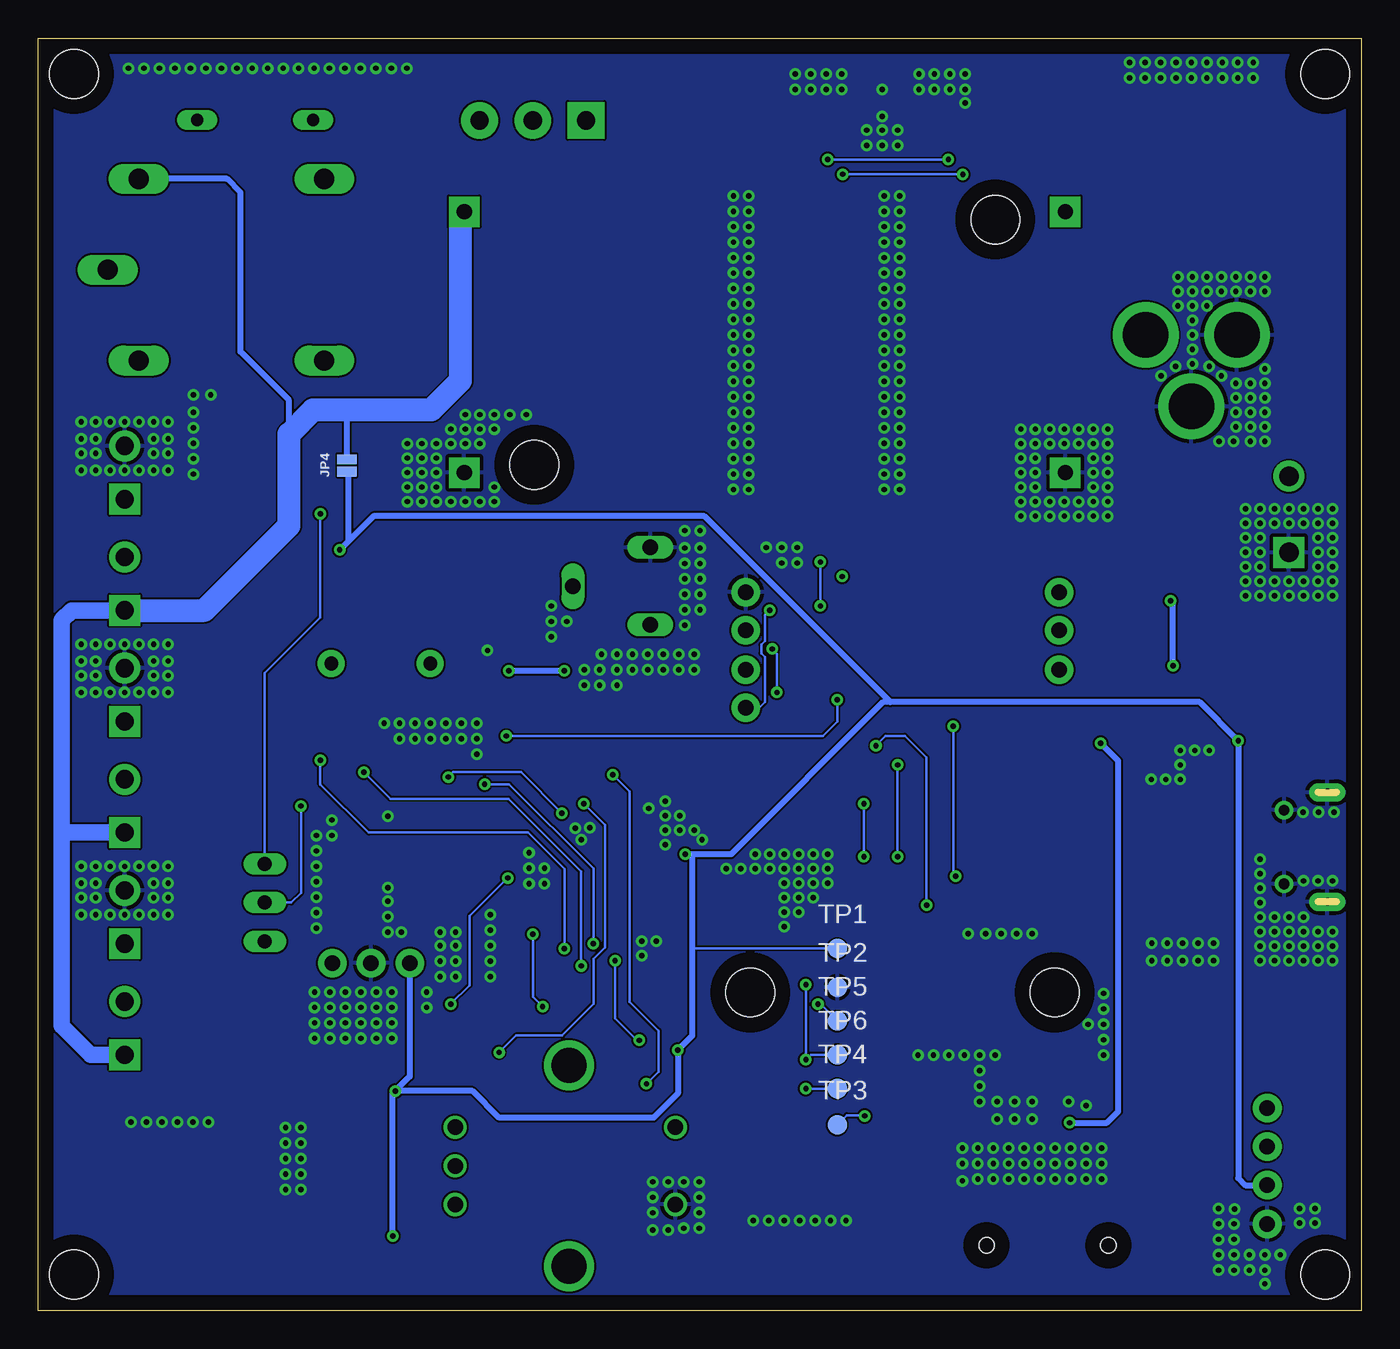
[diagram p4: board, bottom side, seen from below]

Size 86.97 x 83.65 mm. Coordinates in mm from the lower left corner, seen from the top.
Outline: 0,0 86.97,0 86.97,83.65 0,83.65 0,0
Copper layers (1*16): Top 0.035mm / dielectric 1.5mm / Bottom 0.035mm
Design rules "default *": minimum track width 5mil, minimum drill 0.35mm, track to track 5mil, track to pad 0.2mm, pad to pad 5mil, via to via 0.54mm, smd to smd 5mil, copper to edge 40mil, drill to drill 6mil, minimum pad ring 10mil, minimum via ring 8mil, stop-mask expansion 4mil, vias tented up to drill 0.6mm, thermal gap 10mil
Holes 3.2 mm at 2.38,2.38 84.61,2.38 2.38,81.28 84.61,81.28

### Footprints (pad centres in the part's own frame; a part is rotated, then mirrored left to right if it is on the bottom)
C0603 = smd 1.1 x 1: 1 -0.85,0; 2 0.85,0
DO35-7 = drill 0.813 long: A 3.81,0; C -3.81,0
LED-0603 = smd 1 x 1: A -0.877,0; C 0.877,0
1206 = smd 1.6 x 1.8: 1 -1.4,0; 2 1.4,0
1X04 = drill 1.016 pad 1.88: 1 0,0; 2 2.54,0; 3 5.08,0; 4 7.62,0
SCREWTERMINAL-3.5MM-2 = drill 1.2 pad 2.032 square: 1 0,0 | drill 1.2 pad 2.032: 2 3.5,0
1X03 = drill 1.016 pad 1.88: 1 0,0; 2 2.54,0; 3 5.08,0
SCREWTERMINAL-5MM-2 = drill 1.3 pad 2.032 square: 1 0,0 | drill 1.3 pad 2.032: 2 5,0
SCREWTERMINAL-3.5MM-3 = drill 1.2 pad 2.413 square: 1 0,0 | drill 1.2 pad 2.413: 2 3.5,0; 3 7,0
POWER_JACK_PTH = drill 2.997 pad 4.318: GND 0,7.7; GNDBREAK 4.7,10.7; PWR 0,13.7
1X04_1MM_RA = smd 0.6 x 1.35: 1 -1.5,0; 2 -0.5,0; 3 0.5,0; 4 1.5,0 | smd 1.2 x 2: NC1 2.8,-3.675; NC2 -2.8,-3.675
JP2 = drill 0.914 long: 1 -2.54,0; 2 0,0; 3 2.54,0
SMT-JUMPER_2_NC_PASTE_NO-SILK = smd 0.635 x 1.27: 1 -0.406,0; 2 0.406,0
G5LE = drill 1.321 long: 1 -7.493,-5.969; 2 -7.493,5.969; O 4.699,5.969; P -9.525,0; S 4.699,-5.969
BUZZER-12MM = drill 0.9 pad 1.778: + 3.25,0; - -3.25,0
SOT23-3 = smd 0.8 x 0.9: 1 -0.95,-1; 2 0.95,-1; 3 0,1.1
R0603 = smd 1 x 1.1: 1 -0.85,0; 2 0.85,0
CA6V = drill 1.016 long: A -2.54,-2.54; E 2.54,-2.54; S 0,2.54
BORNA-LIB_PCF85063_ERADIONICA = drill 1.016 pad 1.88: 3V3 -10.3,-9.8; CLK_OE 10.3,-9.8; CLK_OUT 10.3,-12.3; GND -10.3,-12.3; INT 10.3,-7.2; SCL -10.3,-4.7; SDA -10.3,-7.2 | hole 3.2: -10,14; 10,14
TACTILE_SWITCH_SMD_5.2MM = smd 1.524 x 0.762: 1 -2.794,1.905; 2 2.794,1.905; 3 -2.794,-1.905; 4 2.794,-1.905
ROTARY_ENC_PLAIN = drill 1.016: A 7.493,-2.54; B 7.493,2.54; C 7.493,0; SW+ -6.985,2.54; SW- -6.985,-2.54 | drill 2.286: P$3 0,6.604; P$4 0,-6.604
BORNA-LIB_MICROSD_HOLDER = smd 0.7 x 1.6: 1 2.25,8; 2 1.15,8; 3 0.05,8; 4 -1.05,8; 5 -2.15,8; 6 -3.25,8; 7 -4.35,8; 8 -5.45,8; 9 -6.55,8 | smd 1.2 x 1.5: PAD1 -7.75,7 | smd 1.6 x 1.5: PAD2 6.85,7 | smd 1.2 x 2.2: PAD3 -7.75,-2.6; PAD4 7.75,-2.6 | hole 1: -4.95,-3; 3.05,-3
B1,27 = smd 1.27 x 1.27: TP 0,0
TQFP32-08 = smd 1.27 x 0.559: 1 -4.293,2.8; 2 -4.293,2; 3 -4.293,1.2; 4 -4.293,0.4; 5 -4.293,-0.4; 6 -4.293,-1.2; 7 -4.293,-2; 8 -4.293,-2.8; 17 4.293,-2.8; 18 4.293,-2; 19 4.293,-1.2; 20 4.293,-0.4; 21 4.293,0.4; 22 4.293,1.2; 23 4.293,2; 24 4.293,2.8 | smd 0.559 x 1.27: 9 -2.8,-4.293; 10 -2,-4.293; 11 -1.2,-4.293; 12 -0.4,-4.293; 13 0.4,-4.293; 14 1.2,-4.293; 15 2,-4.293; 16 2.8,-4.293; 25 2.8,4.293; 26 2,4.293; 27 1.2,4.293; 28 0.4,4.293; 29 -0.4,4.293; 30 -1.2,4.293; 31 -2,4.293; 32 -2.8,4.293
ERADIONICA_U-F-M5DD-Y-L = smd 0.4 x 1.25: 1 1.3,0; 2 0.65,0; 3 0,0; 4 -0.655,0; 5 -1.3,0 | smd 2.54 x 2: PAD 0,3.06 | drill 0.7 pad 1.2: SHIELD1 2.425,0; SHIELD2 -2.425,0 | drill 0.5 pad 1.2 long: SHIELD3 -3.6,2.84; SHIELD4 3.6,2.84
SOP-16 = smd 1.35 x 0.55: 1 -2.625,4.445; 2 -2.625,3.175; 3 -2.625,1.905; 4 -2.625,0.635; 5 -2.625,-0.635; 6 -2.625,-1.905; 7 -2.625,-3.175; 8 -2.625,-4.445; 9 2.625,-4.445; 10 2.625,-3.175; 11 2.625,-1.905; 12 2.625,-0.635; 13 2.625,0.635; 14 2.625,1.905; 15 2.625,3.175; 16 2.625,4.445
ERADIONICA_SOT23-5 = smd 0.55 x 1.2: 1 -0.95,-1.3; 2 0,-1.3; 3 0.95,-1.3; 4 0.95,1.3; 5 -0.95,1.3
STEPDOWN_MODULE_LM2596 = drill 1 pad 2 square: IN+ -19.75,8.572; IN- -19.75,-8.572; OUT+ 19.75,8.572; OUT- 19.75,-8.572 | hole 3.2: -15.146,8.06; 15.146,-8.06
CRYSTAL-SMD-5X3.2-4PAD = smd 1.9 x 1.1: 1 -1.85,-1.15; 2 1.85,-1.15; 3 1.85,1.15; 4 -1.85,1.15

### Placement (x,y rotation side)
C1  47.47,26.67 270 top
C2  39.69,26.67 90 top
C3  47.28,30.64 90 top
C4  62.23,31.43 90 top
C5  8.26,32.7 90 top
C6  19.05,31.43 0 top
C7  60.33,27.3 270 top
C8  2.06,37.15 90 top
C9  14.29,36.83 180 top
C10  19.46,17.14 180 top
C11  75.56,46.04 0 top
C12  75.56,31.43 0 top
C13  75.56,16.83 0 top
C14  66.99,10.48 0 top
C15  66.99,8.57 0 top
C16  6.67,42.23 270 top
C17  12.7,40.01 90 top
C18  60.33,30.48 90 top
C19  67.63,28.57 90 top
D1  72.71,78.26 0 top
D2  9.05,45.24 0 top
D3  9.05,43.66 0 top
D4  1.91,40.96 270 top
F1  5.4,35.88 180 top
J1  6.19,5.71 90 top
J2  81.28,46.04 90 top
J3  81.28,53.34 90 top
J4  81.28,31.43 90 top
J5  81.28,38.73 90 top
J6  81.28,16.83 90 top
J7  81.28,24.13 90 top
J8  62.55,22.86 0 top
J9  4.76,49.85 90 top
J10  50.96,78.23 0 top
J11  0.48,64.14 270 top
J12  27.62,77.95 180 top
J13  35.56,77.95 180 top
JP1  72.07,26.83 90 top
JP2  3.81,42.55 180 top
JP3  5.4,38.1 180 top
JP4  66.67,55.56 90 bottom
K1  72.87,68.42 180 top
LS1  64.45,42.55 0 top
Q1  55.88,45.09 270 top
Q2  36.35,41.91 180 top
Q3  36.35,36.2 180 top
Q4  74.3,59.21 0 top
R1  51.44,38.73 90 top
R2  69.22,48.58 90 top
R3  73.34,6.03 270 top
R4  75.56,49.53 0 top
R5  75.56,53.34 0 top
R6  54.61,38.73 90 top
R7  53.02,38.73 90 top
R8  46.04,38.42 180 top
R9  46.04,36.51 180 top
R10  62.23,27.3 90 top
R11  32.07,15.88 0 top
R12  32.07,21.59 0 top
R13  32.07,19.68 0 top
R14  32.07,17.78 0 top
R15  49.28,47.62 270 top
R16  75.56,34.92 0 top
R17  75.56,38.73 0 top
R18  75.56,20.32 0 top
R19  75.56,24.13 0 top
R20  62.87,12.38 0 top
R21  62.87,6.67 0 top
R22  62.87,10.48 180 top
R23  62.87,8.57 180 top
R24  43.5,15.24 90 top
R25  36.35,44.77 0 top
R26  36.35,39.05 0 top
R27  74.3,56.2 180 top
R28  70.17,56.2 0 top
R29  4.13,40.32 0 top
R30  12.38,45.24 180 top
R31  12.38,43.66 180 top
R32  65.72,32.07 270 top
R33  65.72,26.67 90 top
R34  64.77,29.53 180 top
RTC1  30.16,34.92 180 top
S1  36.83,9.53 180 top
S2  52.07,9.53 0 top
S3  78.42,9.21 0 top
SD1  21.59,7.3 0 top
TP1  34.45,23.81 0 bottom
TP2  34.45,21.27 0 bottom
TP3  34.45,12.22 0 bottom
TP4  34.45,14.61 0 bottom
TP5  34.45,19.05 0 bottom
TP6  34.45,16.83 0 bottom
U1  53.34,30.8 0 top
U$1  5.08,30.48 90 top
U$2  12.7,30.8 0 top
U$3  9.53,40.01 270 top
U$4  39.21,63.66 0 top
Y1  43.66,26.67 180 top

### Tracks (layer width: path | path; a pad name or v marks a point on that pad's centre or on a via)
3V3  (via drill 0.35)
  Top 0.152: 12.6,40.95 C17.2 | R25.2 37.25,44.73 RTC1.3V3 | R25.2 37.46,44.51 37.46,43.66 37.62,43.5 | Q3.1 37.3,38.95 R26.2 38.42,40.27 v38.42,40.64 38.42,40.8 | 20.54,16.92 C10.1 | 12.38,46.51 v12.54,46.67 | R25.2 37.2,46.14 36.12,47.23 RTC1.CLK_OUT | v38.73,43.5 37.62,43.5 | 37.62,43.5 37.3,43.18 Q2.1
  Top 0.406: U$3.5 12.6,40.95 | 20.54,16.92 SD1.4 20.54,13.55 19.35,12.36 v19.18,12.36 | v12.38,42.39 12.7,42.07 C17.2 13.91,40.85 17.14,37.62 v17.14,37.31 | v12.54,46.67 13.09,47.23 RTC1.CLK_OUT 19.92,47.23 24.92,52.23 24.92,66.67 28.12,69.87 J12.2 28.12,79.08 28.42,79.38 35.72,79.38 36.06,79.03 J13.2
  Bottom 0.152: v38.42,40.64 38.42,43.18 v38.73,43.5 | 19.18,12.29 v19.18,12.36
  Bottom 0.406: v17.14,37.31 16,36.16 16,13.08 16.72,12.36 v19.18,12.36 | v12.38,42.39 12.38,46.51 v12.54,46.67
5V  (via drill 0.35)
  Top 0.152: F1.2 2.48,35.88 C8.1 | JP2.1 5.5,42.55 C16.2 | U$2.16 15.14,35.43 C9.1 15.14,36.93 14.29,37.78 9.5,37.78 U$3.3 | 48.56,31.2 U1.4 50.24,31.2 50.48,30.96 50.48,29.84 50.23,29.6 U1.6 47.47,29.6 C3.1 | 8.33,41.06 U$3.1 8.17,41.01 D3.A D2.A | R24.2 44.39,16.99 44.77,16.99 v44.93,17.14 | v63.5,14.45 63.5,12.6 R20.2 | 63.72,4.98 v63.66,4.92 | R1.2 R7.2 R6.2
  Top 0.406: F1.2 4,37.11 JP3.2 4.99,38.96 5.4,39.37 6.03,39.37 6.51,39.85 | 6.51,39.85 6.67,40.01 | 6.67,40.01 C16.2 7.09,40.95 U$3.1 | U$3.3 7.3,39.05 | 7.3,39.05 6.67,39.69 | 6.67,39.69 6.51,39.85 | R10.1 62.23,23.18 J8.1 | 7.3,39.05 8.1,38.26 v8.1,37.47 | v44.45,30 44.66,29.79 C3.1 | 6.67,40.01 6.67,39.69 | R21.2 63.72,4.98 63.92,5.18 R3.2 | R2.2 67.73,49.43 v67.15,50.01 64.29,47.15 64.29,39.85 58.42,39.85 56.2,42.07 v56.04,42.07 | v52.39,42.07 52.39,40.22 R7.2
  Bottom 0.152: 63.66,14.29 v63.5,14.45 | TP1.TP 43.97,23.81
  Bottom 0.406: 30.96,40.01 10.64,40.01 v8.1,37.47 8.1,8.73 7.62,8.26 J1.2 | 30.96,40.01 31.43,40.01 41.43,30 43.97,30 | 43.97,30 v44.45,30 | 43.97,30 43.97,23.81 43.97,18.1 v44.93,17.14 44.93,14.29 46.51,12.7 56.67,12.7 58.42,14.45 v63.5,14.45 62.55,15.4 J8.1 | v63.66,4.92 63.66,14.29 | 30.96,40.01 43.18,52.23 64.93,52.23 66.6,50.56 | 66.6,50.56 v67.15,50.01 | v56.04,42.07 v52.39,42.07 | JP4.1 66.6,55.08 66.6,50.56
5V_BUCK
  Top 0.152: C13.2 J6.1 | C11.2 J2.1 | C12.2 J4.1 | D1.C 69.22,77.95 72.71,77.95 76.2,74.45 80.3,74.45 K1.1
  Bottom 0.406: JP4.2 66.67,59.05 66.52,59.21 | 70.48,57.63 70.48,59.85 73.66,63.02 73.66,73.5 74.55,74.39 K1.1
  Bottom 1.1: J2.1 84.77,46.04 85.41,45.4 85.41,31.43 | 85.41,31.43 85.41,18.73 83.5,16.83 J6.1 | J4.1 85.41,31.43
  Bottom 1.5: J2.1 76.04,46.04 70.48,51.59 70.48,57.63 68.9,59.21 66.52,59.21 61.12,59.21 59.21,61.12 59.21,71.98 U$4.OUT+
AREF
  Top 0.152: U1.20 59.29,30.4 59.37,30.48 62.13,30.48 C4.1 63.39,30.58 R32.1
AUDIOIN
  Top 0.152: U1.19 57.66,29.63 C18.1 63.82,29.63 R34.2
BTN1  (via drill 0.35)
  Top 0.152: S3.4 S3.3 73.76,7.3 R3.1 73.34,12.38 70.17,15.56 64.45,15.56 v59.85,20.16 | U1.22 56.45,32 56.2,31.75 56.2,28.48 56.17,28.45 v56.1,28.45
  Bottom 0.152: v56.1,28.45 58.61,25.94 58.61,21.4 v59.85,20.16
BUZZER
  Top 0.152: U1.26 55.31,35.12 55.31,35.82 57.15,37.66 57.15,39.21 51.28,45.09 R15.E
D0
  Top 0.152: U1.30 52.07,35.16 52.07,36.51 51.75,36.83 48.48,36.83 47.02,38.29 | R8.1 47.02,38.29 | R30.1 22.61,35.87 28.18,35.87 31.5,32.54 40.96,32.54 42.25,33.84 42.25,38.35 43.88,39.98 46.38,39.98 46.86,39.51 46.86,38.29 47.02,38.29
D1
  Top 0.152: R9.1 46.99,36.51 | 46.99,36.51 50.8,36.51 51.34,35.97 U1.31 | R31.1 21.65,35.24 28.05,35.24 31.17,32.12 41.17,32.12 42.88,33.83 42.88,38.23 44,39.35 45.78,39.35 46.08,39.06 46.08,37.43 46.99,36.51
ENC_A  (via drill 0.35)
  Top 0.152: C15.1 R23.1 63.72,8.72 62.93,9.51 61.29,9.51 60.01,10.79 51.12,10.79 v46.99,14.92 | U1.32 49.68,35.09 49.53,35.24 v49.21,35.24
  Bottom 0.152: v49.21,35.24 48.1,34.13 48.1,20.32 46.2,18.41 46.2,15.72 v46.99,14.92
ENC_B  (via drill 0.35)
  Top 0.152: R22.1 C14.1 63.45,10.48 62.83,11.1 62.83,13.69 59.53,16.99 v56.67,16.99 | U1.1 50.86,33.6 v51.12,33.34
  Bottom 0.152: v51.12,33.34 49.72,31.94 49.72,23.88 50.48,23.11 50.48,20.16 52.55,18.1 55.56,18.1 v56.67,16.99
ENC_SW  (via drill 0.35)
  Top 0.152: R24.1 43.5,13.65 S2.SW+ 45.09,15.4 v47.47,17.78 | U1.25 56.14,33.6 49.53,26.99 49.53,23.5 v49.05,23.02
  Bottom 0.152: v49.05,23.02 49.05,19.21 47.62,17.78 v47.47,17.78
GND  (via drill 0.35)
  Top 0.152: R27.1 75.14,58.11 Q4.2 | C10.2 18.34,16.87 SD1.6
  other vias: 40.8,29.05 41.75,29.05 39.85,30 38.89,30 39.85,29.05 37.94,30 38.89,29.05 5.71,25.88 3.81,25.88 6.67,25.88 3.81,24.92 4.76,25.88 4.76,24.92 5.71,24.92 3.81,28.26 6.67,24.92 1.91,24.92 2.86,24.92 2.86,28.26 8.38,3.68 6.35,3.68 8.35,6.7 5.33,3.68 3.05,6.73 7.37,3.68 4.06,5.78 8.38,5.71 4.06,6.73 8.38,4.7 6.67,29.69 6.67,28.73 6.67,27.78 1.81,32.77 6.67,26.83 2.86,51.75 2.86,50.8 3.81,51.75 4.76,51.75 5.71,51.75 6.67,51.75 6.67,50.8 6.67,49.85 2.86,49.85 2.86,48.9 2.86,47.94 3.81,47.94 4.76,47.94 5.71,47.94 6.67,47.94 6.67,48.9 2.86,52.7 3.81,52.7 4.76,52.7 5.71,52.7 6.67,52.7 7.62,52.7 7.62,51.75 7.62,50.8 7.62,49.85 7.62,48.9 7.62,47.94 7.62,46.99 6.67,46.99 5.71,46.99 4.76,46.99 3.81,46.99 2.86,46.99 1.91,46.99 1.91,47.94 1.91,48.9 1.91,49.85 1.91,50.8 1.91,51.75 1.91,52.7 11.91,36.83 10.95,36.83 11.91,35.88 11.91,34.92 12.86,34.92 13.81,34.92 10,36.83 1.91,28.26 19.53,56.99 18.57,56.99 17.62,56.99 17.62,56.04 17.62,55.09 17.62,54.13 17.62,53.18 18.57,53.18 19.53,53.18 20.48,53.18 21.43,53.18 21.43,54.13 21.43,55.09 21.43,56.04 21.43,56.99 20.48,56.99 16.67,53.18 16.67,54.13 16.67,55.09 16.67,56.04 16.67,56.99 16.67,57.94 17.62,57.94 18.57,57.94 19.53,57.94 20.48,57.94 21.43,57.94 22.38,57.94 22.38,56.99 22.38,56.04 22.38,55.09 22.38,54.13 22.38,53.18 22.38,52.23 21.43,52.23 20.48,52.23 19.53,52.23 18.57,52.23 17.62,52.23 16.67,52.23 1.91,23.97 2.86,23.97 3.81,23.97 4.76,23.97 5.71,23.97 6.67,23.97 6.67,23.02 5.71,23.02 4.76,23.02 3.81,23.02 2.86,23.02 1.91,23.02 58.9,56.99 59.85,57.94 58.9,57.94 57.94,57.94 56.99,57.94 55.98,58.9 57.94,56.99 59.85,56.99 60.8,56.99 60.8,56.04 60.8,55.09 60.8,54.13 60.8,53.18 59.85,53.18 58.9,53.18 57.94,53.18 56.99,53.18 56.99,54.13 54.9,58.9 61.75,56.99 61.75,56.04 61.75,55.09 61.75,54.13 61.75,53.18 56.99,58.9 57.94,58.9 58.9,58.9 62.71,56.99 62.71,56.04 62.71,55.09 62.71,54.13 62.71,53.18 81.28,58.42 82.23,58.42 83.19,58.42 84.14,56.36 83.19,57.31 83.19,56.36 83.19,55.24 82.23,55.24 81.28,55.24 80.33,55.24 79.38,55.24 79.38,56.36 84.14,55.24 79.38,57.31 79.38,58.42 80.33,58.42 84.14,57.31 84.14,58.42 78.42,55.24 78.42,56.36 78.42,57.31 78.42,58.42 81.28,40.64 82.23,40.64 83.19,40.64 80.33,40.64 79.38,40.64 78.42,40.64 78.42,41.75 78.42,42.7 78.42,43.81 79.38,43.81 80.33,43.81 81.28,43.81 82.23,43.81 83.19,43.81 83.19,42.7 83.19,41.75 79.38,42.7 79.38,41.75 84.14,43.81 84.14,42.7 84.14,41.75 84.14,40.64 81.28,26.04 82.23,26.04 83.19,26.04 84.14,26.04 84.14,27.15 84.14,28.1 84.14,29.21 83.19,29.21 82.23,29.21 81.28,29.21 80.33,29.21 79.38,29.21 78.42,29.21 78.42,28.1 78.42,27.15 78.42,26.04 79.38,26.04 80.33,26.04 79.38,28.1 79.38,27.15 83.19,28.1 83.19,27.15 8.26,66.99 9.21,66.99 10.16,66.99 10.16,66.04 11.11,66.04 11.11,66.99 11.11,65.09 11.11,64.14 11.11,63.18 11.11,62.23 12.06,66.99 12.06,66.04 7.3,66.99 6.35,66.99 6.35,67.94 7.3,67.94 8.26,67.94 9.21,67.94 10.16,67.94 11.11,67.94 12.06,67.94 6.35,61.91 6.35,60.96 6.35,60.01 7.3,60.01 7.3,60.96 8.26,60.96 8.26,60.01 9.21,61.44 10,62.07 8.26,59.05 8.26,58.1 7.3,59.05 6.35,59.05 6.35,58.1 7.3,58.1 6.35,57.15 7.3,57.15 8.41,57.15 9.37,57.15 12.22,62.07 13.18,61.44 45.75,33.5 46.83,33.02 45.75,32.54 45.75,31.59 45.75,30.64 44.8,32.54 44.8,31.59 43.85,31.59 43.34,30.96 37.94,29.05 37.94,28.1 37.94,27.15 37.94,26.19 37.94,25.24 36.99,26.19 36.99,27.15 36.99,28.1 36.99,29.05 36.99,30 36.04,30 36.04,29.05 36.04,28.1 36.04,27.15 35.08,28.1 35.08,29.05 35.08,30 47.31,24.29 47.31,23.34 46.35,24.29 50.7,31.75 51.66,31.72 51.28,30.96 53.69,28.07 54.71,28.07 53.69,29.08 54.71,29.08 54.71,30.1 57.25,26.04 57.25,25.02 57.25,24 57.25,22.99 57.25,21.97 63.98,25.91 63.98,24.89 63.98,26.92 63.98,27.81 63.09,24.89 63.98,32.51 67.66,32.26 67.66,31.24 68.68,31.24 68.68,30.23 68.68,29.21 68.68,28.19 68.68,27.18 68.68,26.16 68.68,25.15 63.72,20.95 64.74,20.95 65.75,20.95 66.77,20.95 67.79,20.95 68.8,20.95 63.72,19.94 64.74,19.94 65.75,19.94 66.77,19.94 67.79,19.94 68.8,19.94 61.44,20.95 61.44,19.94 68.8,18.92 67.79,18.92 66.77,18.92 65.75,18.92 64.74,18.92 63.72,18.92 63.72,17.91 64.74,17.91 65.75,17.91 66.77,17.91 67.79,17.91 68.8,17.91 58.13,38.61 59.15,38.61 60.17,38.61 61.18,38.61 62.2,38.61 63.21,38.61 64.23,38.61 58.13,37.59 59.15,37.59 60.17,37.59 61.18,37.59 62.2,37.59 63.21,37.59 58.13,36.58 30.48,77.6 31.5,77.6 31.5,78.49 32.51,77.6 31.5,80.26 30.48,76.58 31.5,76.58 32.51,76.58 34.16,80.26 35.18,80.26 36.2,80.26 37.21,80.26 29.08,80.26 28.07,80.26 27.05,80.26 26.04,80.26 26.04,79.38 27.05,81.28 28.07,81.28 34.16,81.28 35.18,81.28 29.08,81.28 26.04,81.28 36.2,81.28 37.21,81.28 43.47,50.13 44.48,50.13 44.48,51.28 43.47,51.28 44.48,49.12 43.47,49.12 43.47,48.1 44.48,48.1 44.48,47.09 43.47,47.09 44.48,46.07 43.47,46.07 44.48,45.05 53.24,45.31 53.24,44.29 53.24,46.32 57.44,43.4 52.23,45.31 51.09,42.13 50.07,42.13 48.93,42.13 47.91,42.13 46.89,42.13 45.88,42.13 44.86,42.13 43.85,42.13 44.86,43.15 45.88,43.15 43.85,43.15 46.89,43.15 47.91,43.15 48.93,43.15 48.93,41.12 50.07,41.12 51.09,41.12 49.94,43.15 76.77,59.05 76.77,58.04 76.77,57.02 76.77,56.01 76.77,54.99 76.77,60.2 75.63,60.2 59.53,24.89 60.55,24.89 59.53,24 60.55,24 59.53,22.99 59.53,21.97 60.55,22.99 60.55,21.97 3.05,5.78 6.35,1.78 6.35,2.67 7.37,2.67 8.38,2.67 9.4,2.67 9.4,3.68 9.4,4.7 9.4,5.71 9.4,6.73 37.08,49.15 38.1,49.15 37.08,50.16 38.1,50.16 39.12,50.16 33.88,5.94 34.89,5.94 35.91,5.94 36.93,5.94 37.94,5.94 38.96,5.94 39.97,5.94 75.79,12.41 76.8,12.41 77.82,12.41 78.84,12.41 79.85,12.41 80.87,12.41 69.69,12.03 69.69,11.02 69.69,10 69.69,8.99 69.69,7.97 70.71,7.97 70.71,8.99 70.71,10 70.71,11.02 70.71,12.03 43.53,8.48 44.55,8.48 45.56,8.48 46.58,8.48 46.58,7.46 46.58,6.45 46.58,5.3 43.53,7.46 43.53,6.45 43.53,5.43 44.55,5.43 45.56,5.3 16.95,20.86 16.95,19.84 16.95,18.83 16.95,17.81 17.97,18.83 16.95,16.8 18.1,13.49 19.24,13.75 21.65,13.75 22.8,13.75 23.94,13.75 25.08,13.75 21.65,12.6 22.8,12.6 23.94,12.6 25.08,14.76 25.08,15.78 25.08,16.8 26.1,16.8 27.11,16.8 28.13,16.8 29.15,16.8 24.07,16.8 19.11,10.7 20.13,10.7 21.15,10.7 22.16,10.7 23.18,10.7 24.19,10.7 25.21,10.7 26.23,10.7 18.1,10.7 17.08,10.7 17.08,9.68 18.1,9.68 19.11,9.68 20.13,9.68 21.15,9.68 22.16,9.68 23.18,9.68 24.19,9.68 25.21,9.68 26.23,9.68 26.23,8.54 25.21,8.67 24.19,8.67 23.18,8.67 22.16,8.67 21.15,8.67 20.13,8.67 19.11,8.67 18.1,8.67 17.08,8.67 21.65,24.8 22.67,24.8 23.69,24.8 24.7,24.8 25.84,24.8 9.72,24.16 10.73,24.16 11.75,24.16 12.76,24.16 13.78,24.16 9.72,23.02 10.73,23.02 11.75,23.02 12.76,23.02 13.78,23.02 7.11,82.04 8.13,82.04 9.14,82.04 10.16,82.04 11.18,82.04 12.19,82.04 13.21,82.04 14.22,82.04 15.24,82.04 7.11,81.03 8.13,81.03 9.14,81.03 10.16,81.03 11.18,81.03 12.19,81.03 13.21,81.03 14.22,81.03 15.24,81.03 40.26,72.26 40.26,71.25 40.26,70.23 40.26,69.22 40.26,68.2 40.26,67.18 40.26,66.17 40.26,65.15 40.26,64.14 40.26,63.12 40.26,62.1 40.26,61.09 40.26,60.07 41.27,60.07 41.27,61.09 41.27,62.1 41.27,63.12 41.27,64.14 41.27,65.15 41.27,66.17 41.27,67.18 41.27,68.2 41.27,69.22 41.27,70.23 41.27,71.25 41.27,72.26 40.26,59.05 41.27,59.05 41.27,58.04 40.26,58.04 40.26,57.02 41.27,57.02 41.27,56.01 40.26,56.01 40.26,54.99 41.27,54.99 41.27,53.98 40.26,53.98 40.26,73.28 41.27,73.28 31.37,73.28 30.35,73.28 30.35,72.26 31.37,72.26 31.37,71.25 30.35,71.25 30.35,70.23 31.37,70.23 30.35,69.22 31.37,69.22 30.35,68.2 31.37,68.2 30.35,67.18 31.37,67.18 30.35,66.17 30.35,65.15 30.35,64.14 30.35,63.12 30.35,62.1 30.35,61.09 30.35,60.07 30.35,59.05 30.35,58.04 30.35,57.02 30.35,56.01 30.35,54.99 30.35,53.98 31.37,66.17 31.37,65.15 31.37,64.14 31.37,63.12 31.37,62.1 31.37,61.09 31.37,60.07 31.37,59.05 31.37,58.04 31.37,57.02 31.37,56.01 31.37,54.99 31.37,53.98 62.74,81.66 63.75,81.66 64.77,81.66 65.79,81.66 66.8,81.66 67.82,81.66 68.83,81.66 69.85,81.66 70.87,81.66 71.88,81.66 72.9,81.66 73.91,81.66 74.93,81.66 75.95,81.66 76.96,81.66 77.98,81.66 78.99,81.66 80.01,81.66 81.03,81.66 2.83,32.77 3.84,32.77
  pour Top: 0,0 87,0 87,83.66 0,83.66
  pour Bottom: 0,0 87,0 87,83.66 0,83.66
I2C_SCL  (via drill 0.35)
  Top 0.152: U1.28 53.74,37.17 R7.1 53.02,38.42 52.7,38.73 49.21,38.73 47.47,40.48 43.5,40.48 41.12,38.1 41.12,36.67 39.54,35.09 Q3.3 33.96,35.09 v31.91,37.15 | v28.57,26.67 20.32,26.67 8.1,14.45 8.1,11.43 7.46,10.79 J1.3
  Bottom 0.152: v31.91,37.15 31.27,37.78 30,37.78 28.57,36.35 v28.57,26.67
I2C_SCL_L  (via drill 0.35)
  Top 0.152: R26.1 35.4,38.95 Q3.2 36.4,36.2 39.37,36.2 40.46,37.29 RTC1.SCL | J12.4 26.12,74.75 v26.19,74.68 | J13.4 34.09,77.92 v34.09,74.7 34.09,48.3 v34.13,48.26 36.67,48.26 v38.89,46.04
  Bottom 0.152: v26.19,74.68 26.23,74.71 34.08,74.71 v34.09,74.7 | v38.89,46.04 39.21,45.72 39.21,44.02 39.44,43.79 39.44,43.2 39.21,42.97 39.21,40.01 39.59,39.62 RTC1.SCL
I2C_SDA  (via drill 0.35)
  Top 0.152: R6.1 54.54,37.81 | 54.54,37.81 U1.27 | Q2.3 35.09,40.81 v34.45,40.16 32.7,38.42 v26.83,38.42 | 54.54,37.81 54.57,37.78 v56.2,37.78 56.36,37.78 | v26.67,28.57 20.95,28.57 6.19,13.81 J1.4
  Bottom 0.152: v56.2,37.78 35.4,37.78 34.45,38.73 v34.45,40.16 | v26.83,38.42 26.83,28.73 v26.67,28.57
I2C_SDA_L  (via drill 0.35)
  Top 0.152: RTC1.SDA 36.19,42.12 Q2.2 35.4,44.67 R25.1 35.56,44.82 v35.56,46.32 | J12.3 27.15,77.92 v27.15,75.66 | J13.3 35.08,77.92 v35.08,75.66 35.56,75.18 v35.56,49.21
  Bottom 0.152: v35.08,75.66 v27.15,75.66 | v35.56,46.32 v35.56,49.21
LED1_CI  (via drill 0.35)
  Top 0.152: U1.9 50.48,26.45 v50.48,24.13 | v57.63,34.61 59.05,36.04 63.34,36.04 70.97,43.67 70.97,50.45 73.86,53.34 R5.1
  Bottom 0.152: v50.48,24.13 50.48,29.08 56.01,34.61 v57.63,34.61
LED1_DI  (via drill 0.35)
  Top 0.152: v60.01,35.08 63.66,35.08 72.55,43.97 72.55,48.74 73.34,49.53 R4.1 | U1.2 50.23,32.8 50.48,32.54 52.39,32.54 v52.55,32.7
  Bottom 0.152: v52.55,32.7 55.24,35.4 59.69,35.4 v60.01,35.08
LED2_CI  (via drill 0.35)
  Top 0.152: U1.11 52.14,24.06 v52.39,23.81 | v68.42,36.2 70.96,38.73 R17.1
  Bottom 0.152: v52.39,23.81 52.39,29.05 54.77,31.43 65.25,31.43 68.42,34.61 v68.42,36.2
LED2_DI  (via drill 0.35)
  Top 0.152: U1.10 51.34,22.67 v51.28,22.67 | R16.1 66.04,34.92 v65.56,35.4
  Bottom 0.152: v51.28,22.67 51.28,28.89 56.04,33.66 63.82,33.66 v65.56,35.4
LED3_CI
  Top 0.152: JP1.1 72.23,24.13 R19.1
LED3_DI
  Top 0.152: U1.23 57.7,32.86 60.96,32.86 61.91,33.81 67.47,33.81 69.93,31.35 69.93,21.51 71.12,20.32 R18.1
MICIN
  Top 0.152: 65.72,29.63 R34.1 | R34.1 65.62,27.62 R33.2 | R32.2 65.62,31.11 R34.1 | R34.1 65.72,29.43 C19.2
N$1
  Top 0.152: J8.3 C19.1
N$3
  Top 0.152: S2.B 59.88,12.38 R20.1 R22.2
N$4
  Top 0.152: Q1.3 58.66,45.09 LS1.-
N$5
  Top 0.152: LS1.+ 69.22,44.06 R2.1
N$6
  Top 0.152: U1.7 arc-90 48.98,28.73 44.29,28.73 arc90 43.66,28.1 43.66,26.35 arc-90 42.86,25.56 41.84,25.56 arc90 Y1.3 39.99,25.52 arc-90 C2.1
N$7
  Top 0.152: Y1.1 45.55,27.77 | 45.55,27.77 45.81,27.52 | U1.8 47.94,28 arc90 C1.1 45.81,27.52 | 45.81,27.52 arc-90 45.55,27.77
N$8
  Top 0.152: U$2.4 8.68,31.43 C5.1
N$9
  Top 0.152: U$2.13 C6.1
N$14
  Top 0.152: U$1.2 7.29,31.13 7.65,30.77 11.14,30.77 11.43,30.48 11.43,29.21 11.11,28.89 U$2.6
N$15
  Top 0.152: U$1.3 7.22,30.48 7.54,30.16 U$2.5
N$16
  Top 0.406: U$1.1 6.06,31.78 6.8,32.52 F1.1 6.8,37.11 JP3.1
N$17
  Top 0.152: U1.18 59.68,28.8 C7.1 R10.2
N$18
  Top 0.152: S2.A 59.88,6.67 R21.1 R23.2
N$20
  Top 0.152: R15.S 53.29,47.62 Q1.1
N$22
  Top 0.152: R4.2 J2.2
N$23
  Top 0.152: R5.2 J3.1
N$25
  Top 0.152: SD1.7 17.24,11.94 17.56,11.62 24.64,11.62 26.04,13.02 26.04,15.56 26.35,15.88 R11.1
N$26
  Top 0.152: SD1.5 19.44,16.87 19.44,17.9 19.73,18.19 21.42,18.19 24.82,21.59 R12.1
N$27
  Top 0.152: SD1.3 21.64,16.88 24.45,19.68 R13.1
N$28
  Top 0.152: SD1.2 22.74,16.71 23.81,17.78 R14.1
N$30
  Top 0.152: Q4.1 73.34,56.3 R27.2 R28.2
N$31
  Top 0.152: D1.A 81.6,78.26 85.25,74.61 85.25,64.29 83.41,62.45 K1.2 76.43,62.45 Q4.3
N$33
  Top 0.152: R16.2 J4.2
N$34
  Top 0.152: R17.2 J5.1
N$36
  Top 0.152: JP2.2 2.62,42.55 D4.A
N$37
  Top 0.152: R18.2 76.42,20.33 J6.2
N$38
  Top 0.152: R19.2 J7.1
N$39
  Top 0.152: R29.1 2.15,40.32 D4.C
N$40
  Top 0.152: R30.2 D2.C
N$41
  Top 0.152: R31.2 D3.C
PC1  (via drill 0.35)
  Top 0.152: U1.24 58.74,33.6 59.44,34.29 68.58,34.29 v69.69,33.18
  Bottom 0.152: v69.69,33.18 69.69,27.46 70.33,26.83 JP1.2
R_C
  Top 1.5: J10.2 54.46,70.64 56.67,68.42 K1.P
R_NC
  Top 1.5: J10.1 50.96,64.29 52.8,62.45 K1.O
R_NO
  Top 1.5: J10.3 61.8,74.39 K1.S
RELAY  (via drill 0.35)
  Top 0.152: R28.1 69.32,53.28 v68.42,52.39
  Bottom 0.152: v68.42,52.39 68.42,45.56 72.07,41.91 JP1.3
RESET  (via drill 0.35)
  Top 0.152: R1.1 52.94,36.38 U1.29 52.94,34.37 52.75,34.18 50.15,34.18 50.03,34.29 45.52,34.29 42.02,30.8 26.51,30.8 | C6.2 25.88,31.43 26.51,30.8 | 26.51,30.8 32.07,25.24 32.07,13.4 v32.66,12.81 S1.4 S1.3
  Bottom 0.152: 34.92,12.22 TP3.TP 33.81,12.86 32.7,12.86 v32.66,12.81
RTC_CLK  (via drill 0.35)
  Top 0.152: U1.13 53.74,22.62 52.39,21.27 46.67,21.27 44.33,23.62 36.71,23.62 v30.48,29.84 | RTC1.CLK_OE 20.2,44.73 21.59,43.34 21.59,39.21 23.65,37.15 29.21,37.15 v30.48,35.88
  Bottom 0.152: v30.48,29.84 v30.48,35.88
RTC_INT  (via drill 0.35)
  Top 0.152: U1.12 52.94,25.55 53.1,25.4 53.1,23.17 51.67,21.75 47.47,21.75 44.93,24.29 37.62,24.29 32.7,29.21 v32.7,29.84 | v32.7,33.34 31.75,33.34 28.57,36.51 23.02,36.51 19.86,39.67 RTC1.INT
  Bottom 0.152: v32.7,29.84 v32.7,33.34
RX
  Top 0.152: U$2.3 13.97,32.7 14.61,33.34 28.1,33.34 30.16,31.27 41.75,31.27 43.97,33.5 43.97,36.2 44.29,36.51 R9.2
SD_CS  (via drill 0.35)
  Top 0.152: R14.2 41.91,17.78 44.13,20 v53.82,20 | v54.45,24.77 54.54,24.85 U1.14
  Bottom 0.152: v53.82,20 54.45,20.64 v54.45,24.77
SPI_MISO  (via drill 0.35)
  Top 0.152: 34.66,15.88 36.1,17.32 42.35,17.32 44.25,19.21 55.24,19.21 56.14,20.1 U1.16 | 34.66,15.88 R11.2 32.86,15.82 | 34.66,15.88 35.24,15.88 v36.51,14.61
  Bottom 0.152: TP4.TP v36.51,14.61
SPI_MOSI  (via drill 0.35)
  Top 0.152: 34.9,19.68 36.35,18.23 41.41,18.23 43.97,20.8 53.02,20.8 55.34,23.11 U1.15 | R13.2 34.9,19.68 | v35.72,20.16 35.24,19.68 34.9,19.68
  Bottom 0.152: v35.72,20.16 35.56,20.16 TP5.TP
SPI_SCK  (via drill 0.35)
  Top 0.152: R12.2 33.08,21.43 v36.51,21.43 | 57.89,28 57.78,28 | 57.78,28 U1.17 | v36.51,16.51 36.67,16.67 42.55,16.67 44.45,18.57 55.56,18.57 58.1,21.11 58.1,27.68 57.78,28
  Bottom 0.152: v36.51,21.43 v36.51,16.51 36.2,16.83 TP6.TP
TX
  Top 0.152: U$2.2 13.97,33.97 14.61,34.61 27.78,34.61 30.64,31.75 41.59,31.75 43.34,33.5 43.34,37.94 43.81,38.42 R8.2
VIN
  Top 1.27: J9.2 4.76,68.42 6.19,69.85 14.29,69.85 | 14.29,69.85 17.08,69.85 U$4.IN+ | J11.PWR 14.29,64.25 14.29,69.85

### Text on the board
200bmp: NO C NC | easyC | DO NOT / CONNECT / AC MAINS! | 9-24VDC | 3A MAX | 9-24VDC / 5A MAX | Volume | PWR LED | UART / LEDs | LED1 OUT | 5V DI CI GND | LED2 OUT | USB / 2.1A MAX | ANALOG IN | LED3 OUT | RESET | Borna Biro 16.11.20. | LED Party/Xmas Light controller
201bmp: 5V | GND | MOSI | SCK | MISO | RESET